# EAGLE schematic 197504_Kalibrierumschaltbaugruppe_seriell_2017_09_06_komplett (EAGLE 6.4)
Assembly variants: Relais_Switchbox_USB, Development_Board_Graphic_LCD, Development_Board_7_Segment_2017

## Sheet 1 of 8
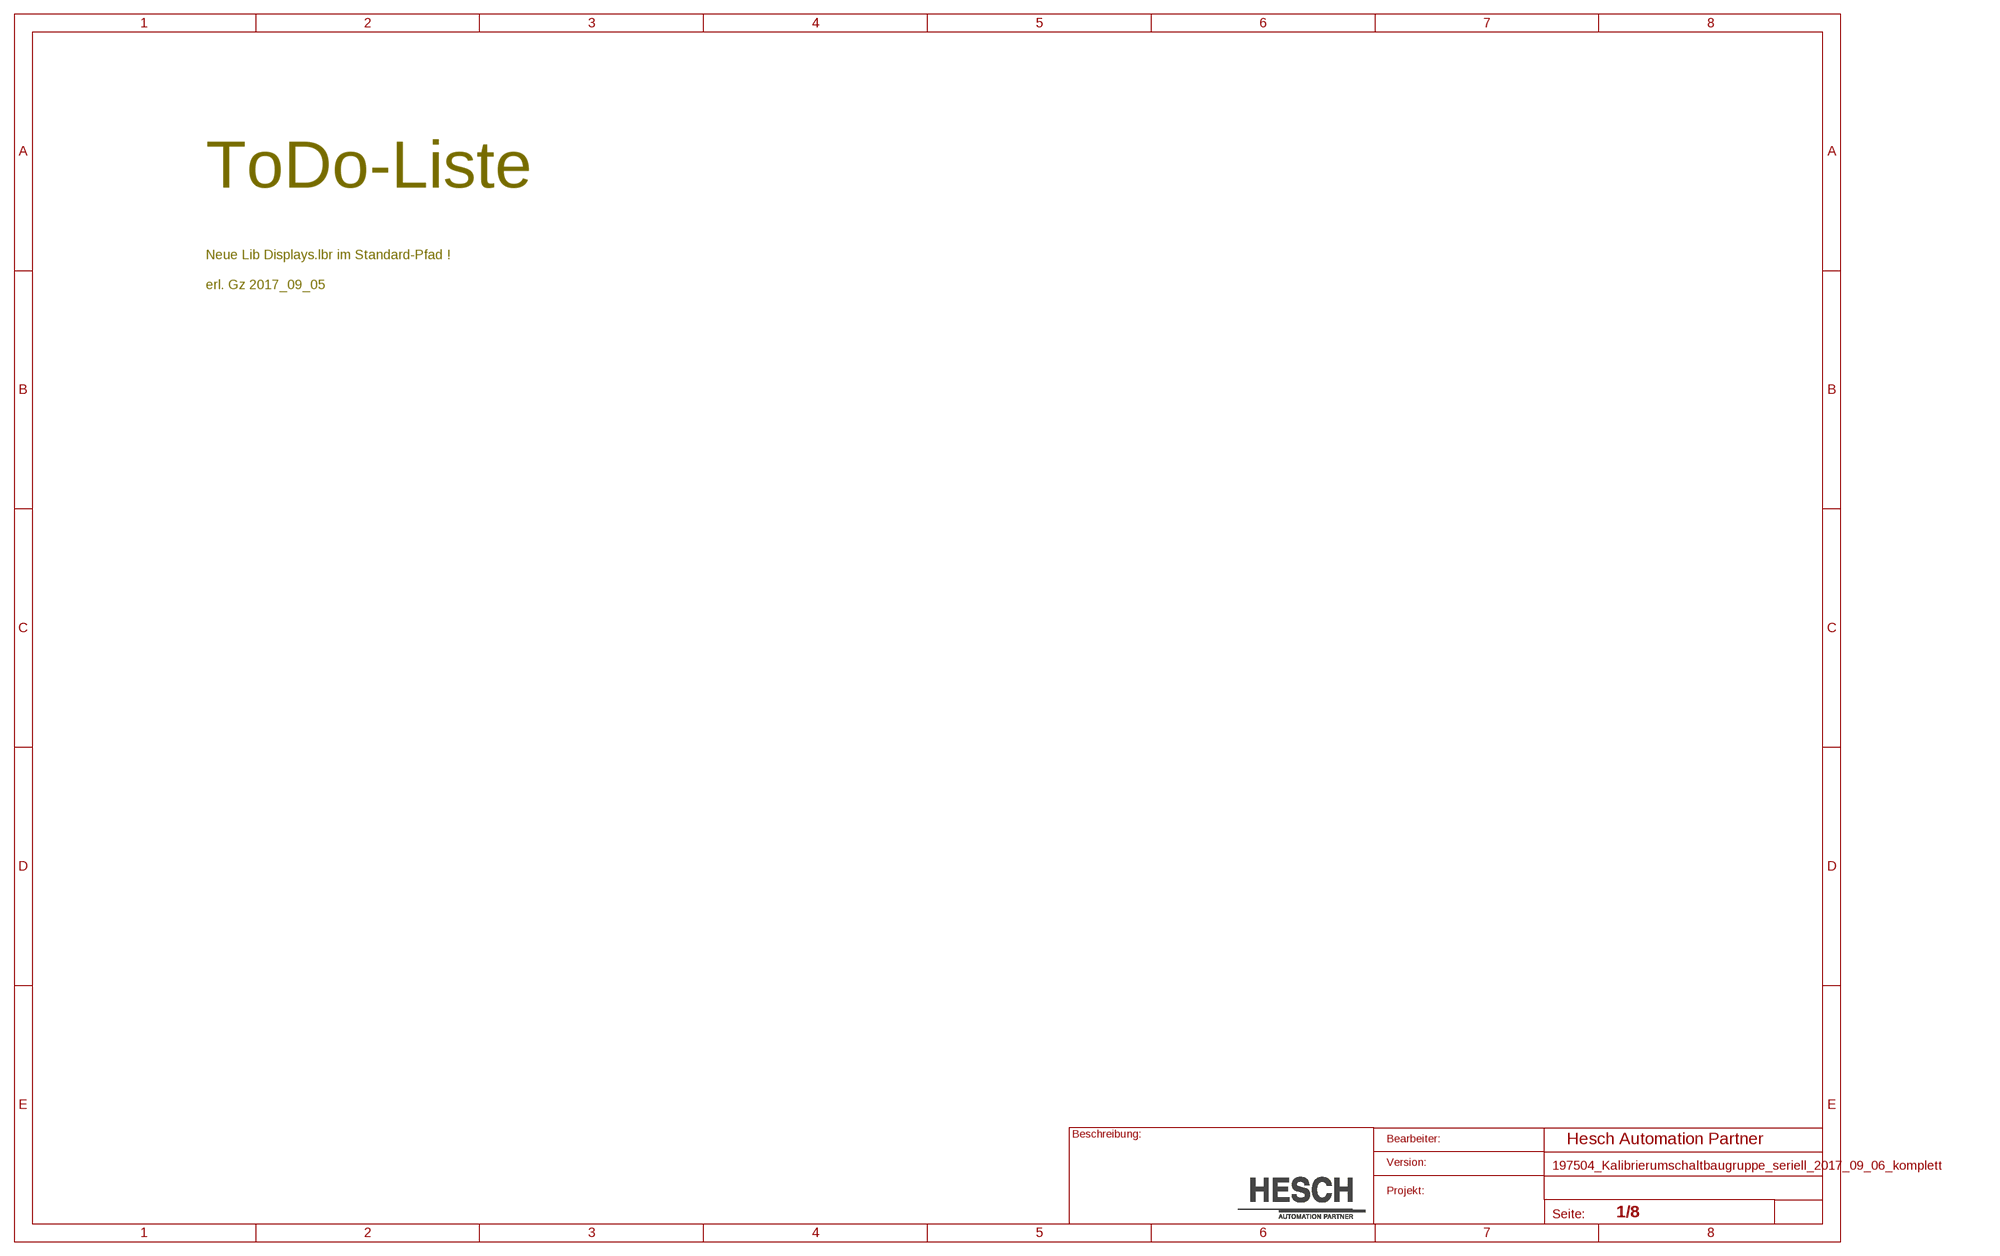
[diagram p0: schematic, sheet 1]

### Notes on the sheet
- ToDo-Liste
- Neue Lib Displays.lbr im Standard-Pfad !
- erl. Gz 2017_09_05

## Sheet 2 of 8
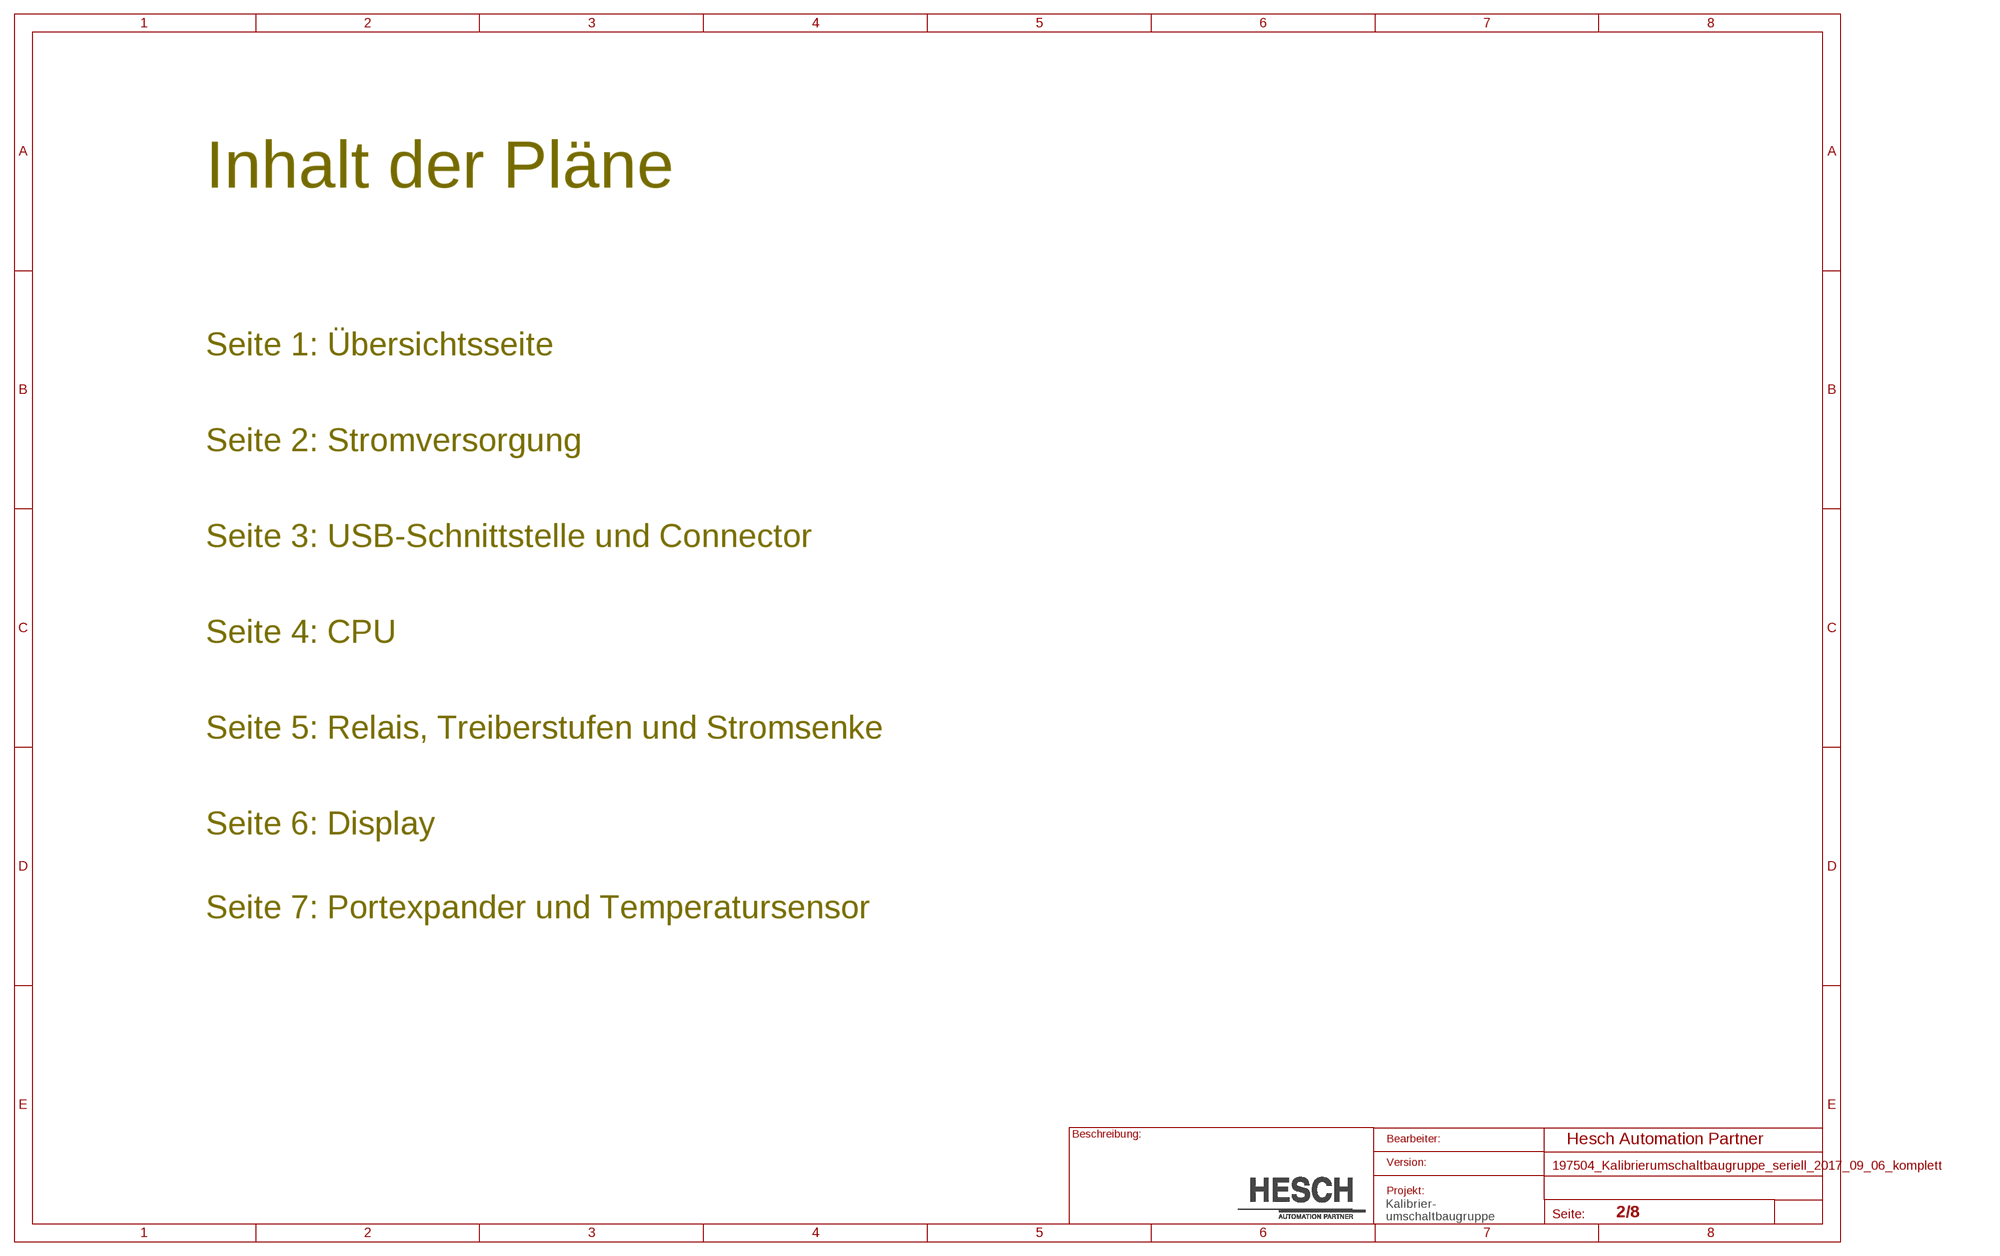
[diagram p1: schematic, sheet 2]

### Notes on the sheet
- Inhalt der Pläne
- Seite 1: Übersichtsseite
- Seite 2: Stromversorgung
- Seite 3: USB-Schnittstelle und Connector
- Seite 4: CPU
- Seite 5: Relais, Treiberstufen und Stromsenke
- Seite 6: Display
- Seite 7: Portexpander und Temperatursensor
- Kalibrier-
  umschaltbaugruppe

## Sheet 3 of 8
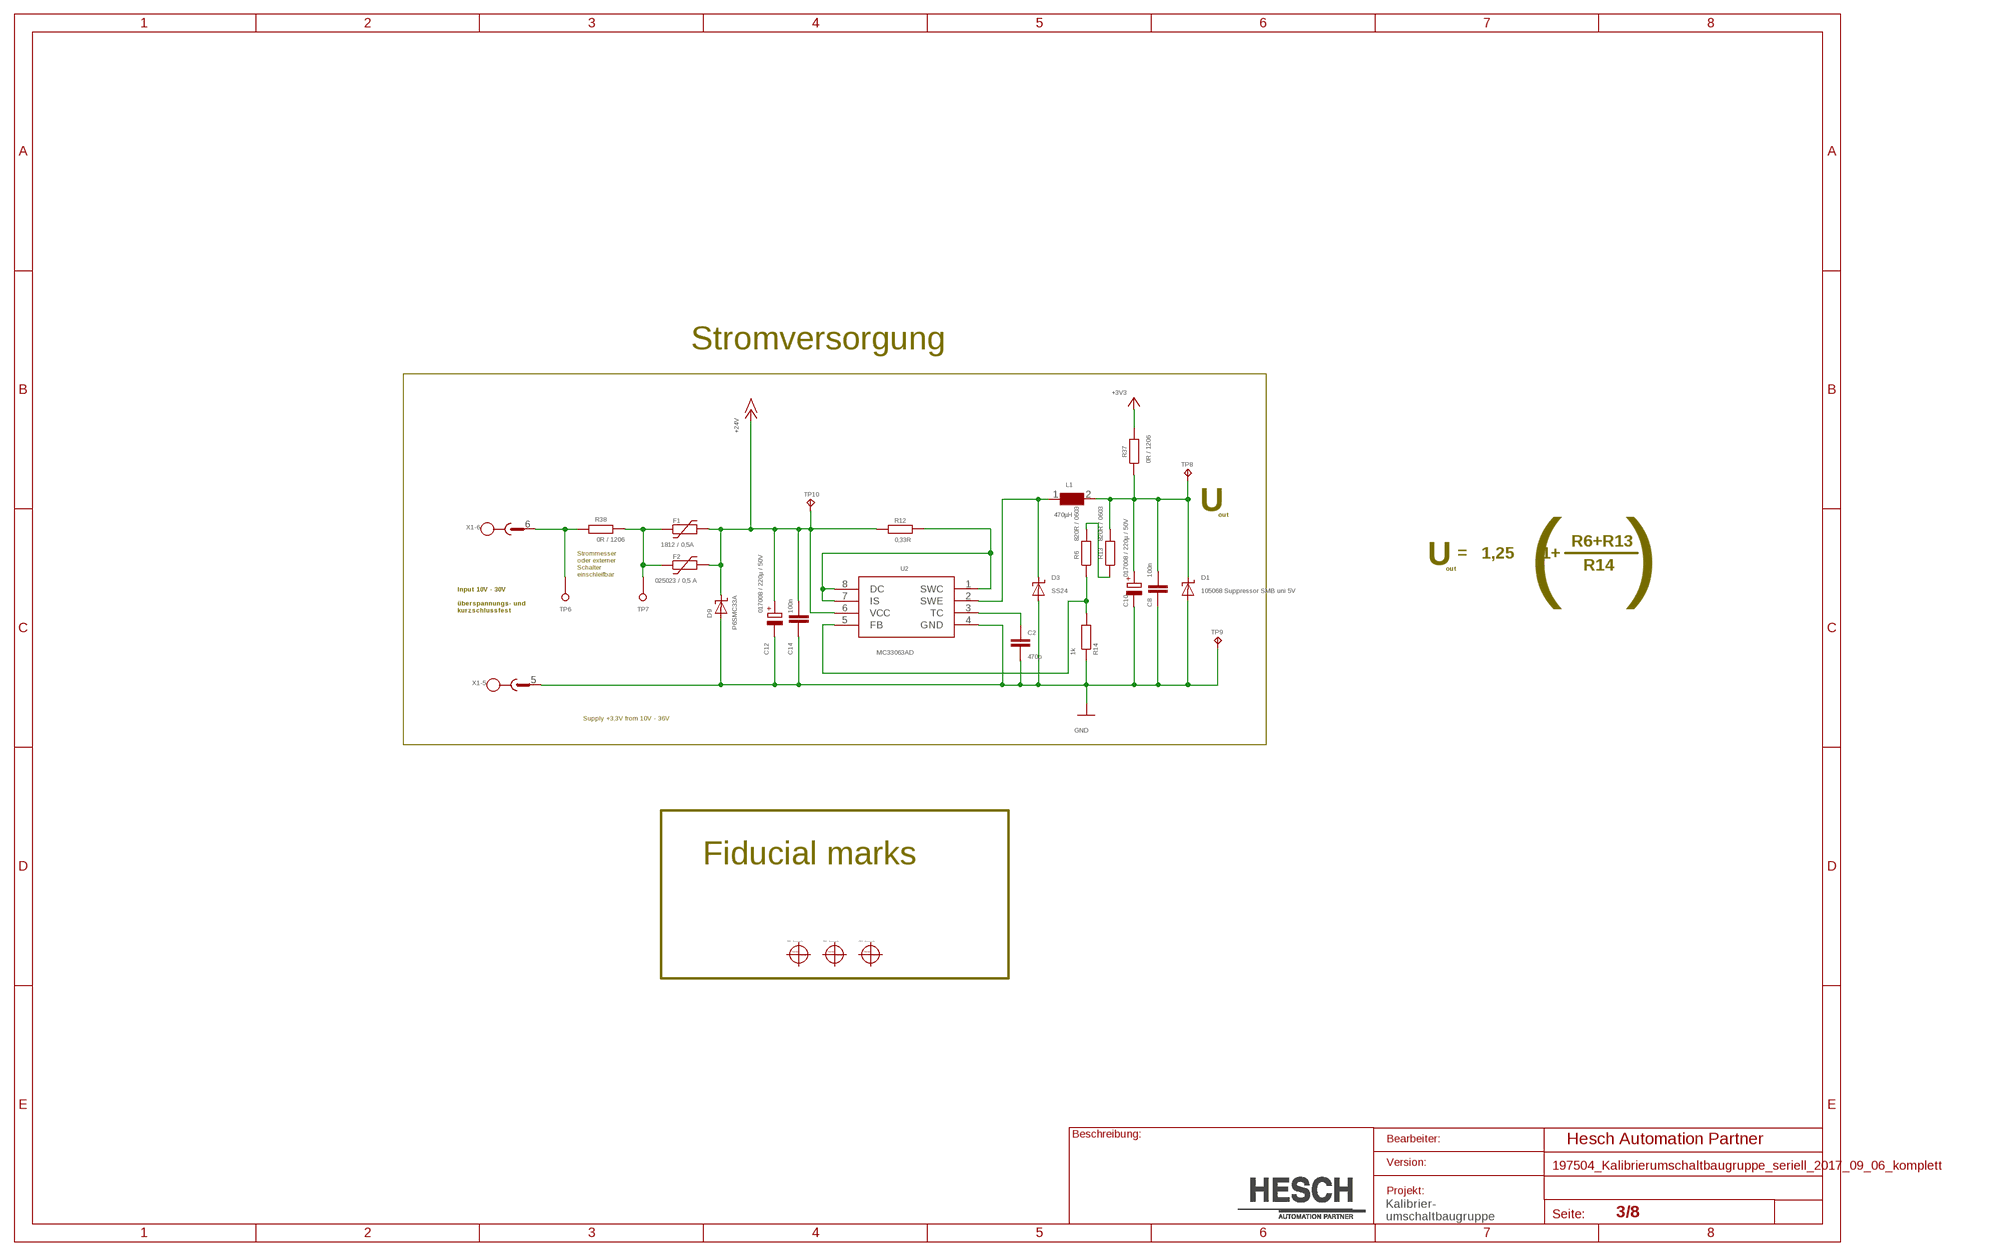
[diagram p2: schematic, sheet 3]

### Parts
C2  470p  C-EUC0603  [C0603]
C8  100n  C-EUC0603  [C0603]
C10  017008 / 220µ / 50V  CPOL-EU153CLV-1014  [153CLV-1014]
C12  017008 / 220µ / 50V  CPOL-EU153CLV-1014  [153CLV-1014]
C14  100n  C-EUC0603  [C0603]
D1  105068 Suppressor SMB uni 5V  SUPPRESSOR-SMBJ  [SMBJ]
D3  SS24  SUPPRESSOR-SMBJ  [SMBJ]
D9  P6SMC33A  SUPPRESSOR-SMCJ  [SMC]
F1  1812 / 0,5A  1812SMD  [1812L]  (not fitted in variant Relais_Switchbox_USB)  (not fitted in variant Development_Board_Graphic_LCD)  (not fitted in variant Development_Board_7_Segment_2017)
F2  025023 / 0,5 A  1206LSMD  [1206L]
FIDU1  Passermarke  FIDUCIALSMARKE_1MM  [PASSER_1MM]
FIDU2  Passermarke  FIDUCIALSMARKE_1MM  [PASSER_1MM]
FIDU3  Passermarke  FIDUCIALSMARKE_1MM  [PASSER_1MM]
L1  470µH  WE-PD4_L  [L]
R6  820R / 0603  R-EU_R0603  [R0603]
R12  0,33R  R-EU_R1206  [R1206]
R13  820R / 0603  R-EU_R0603  [R0603]
R14  1k  R-EU_R0603  [R0603]
R37  0R / 1206  R-EU_R1206  [R1206]
R38  0R / 1206  R-EU_R1206  [R1206]
TP6  Testpunkt_mit_Bohrung  PAD´S8  [THT-1X2,54]
TP7  Testpunkt_mit_Bohrung  PAD´S8  [THT-1X2,54]
TP8  TPB2,54  [B2,54]
TP9  TPB2,54  [B2,54]
TP10  TPB2,54  [B2,54]
U2  MC33063AD  MC34063AD  [SOIC8]
X1  MSTB 2,5/6-GF-5,08 AU ( Phoenix: 1949364 )  MSTB6_GF  [MSTB6_GF]

### Nets
3V3_STABILIZED_OUT: C8.1 C10.+ D1.C L1.2 R13.2 R37.1 TP8.PP(TP)
+3V3: R37.2 ; also sheet 5,6,7,8
+24V: C12.+ C14.1 D9.C F1.2 F2.2 R12.2 TP10.PP(TP) U2.6(VCC)
GND: C2.2 C8.2 C10.- C12.- C14.2 D1.A D3.A D9.A R14.1 TP9.PP(TP) U2.4(GND) X1.5 ; also sheet 4,5,6,7,8
N$3: F1.1 F2.1 R38.1 TP7.TP
N$25: R12.1 U2.1(SWC) U2.7(IS) U2.8(DC)
N$27: R6.2 R13.1
N$29: D3.C L1.1 U2.2(SWE)
N$30: R6.1 R14.2 U2.5(FB)
N$31: R38.2 TP6.TP X1.6
N$33: C2.1 U2.3(TC)

### Notes on the sheet
- Stromversorgung
- U
- out
- R6+R13
- = | 1,25 | 1+
- U
- out | R14
- Strommesser
  oder externer
  Schalter
  einschleifbar
- ( | )
- Input 10V - 30V
  
  überspannungs- und
  kurzschlussfest
- Supply +3,3V from 10V - 36V
- Fiducial marks
- Kalibrier-
  umschaltbaugruppe

## Sheet 4 of 8
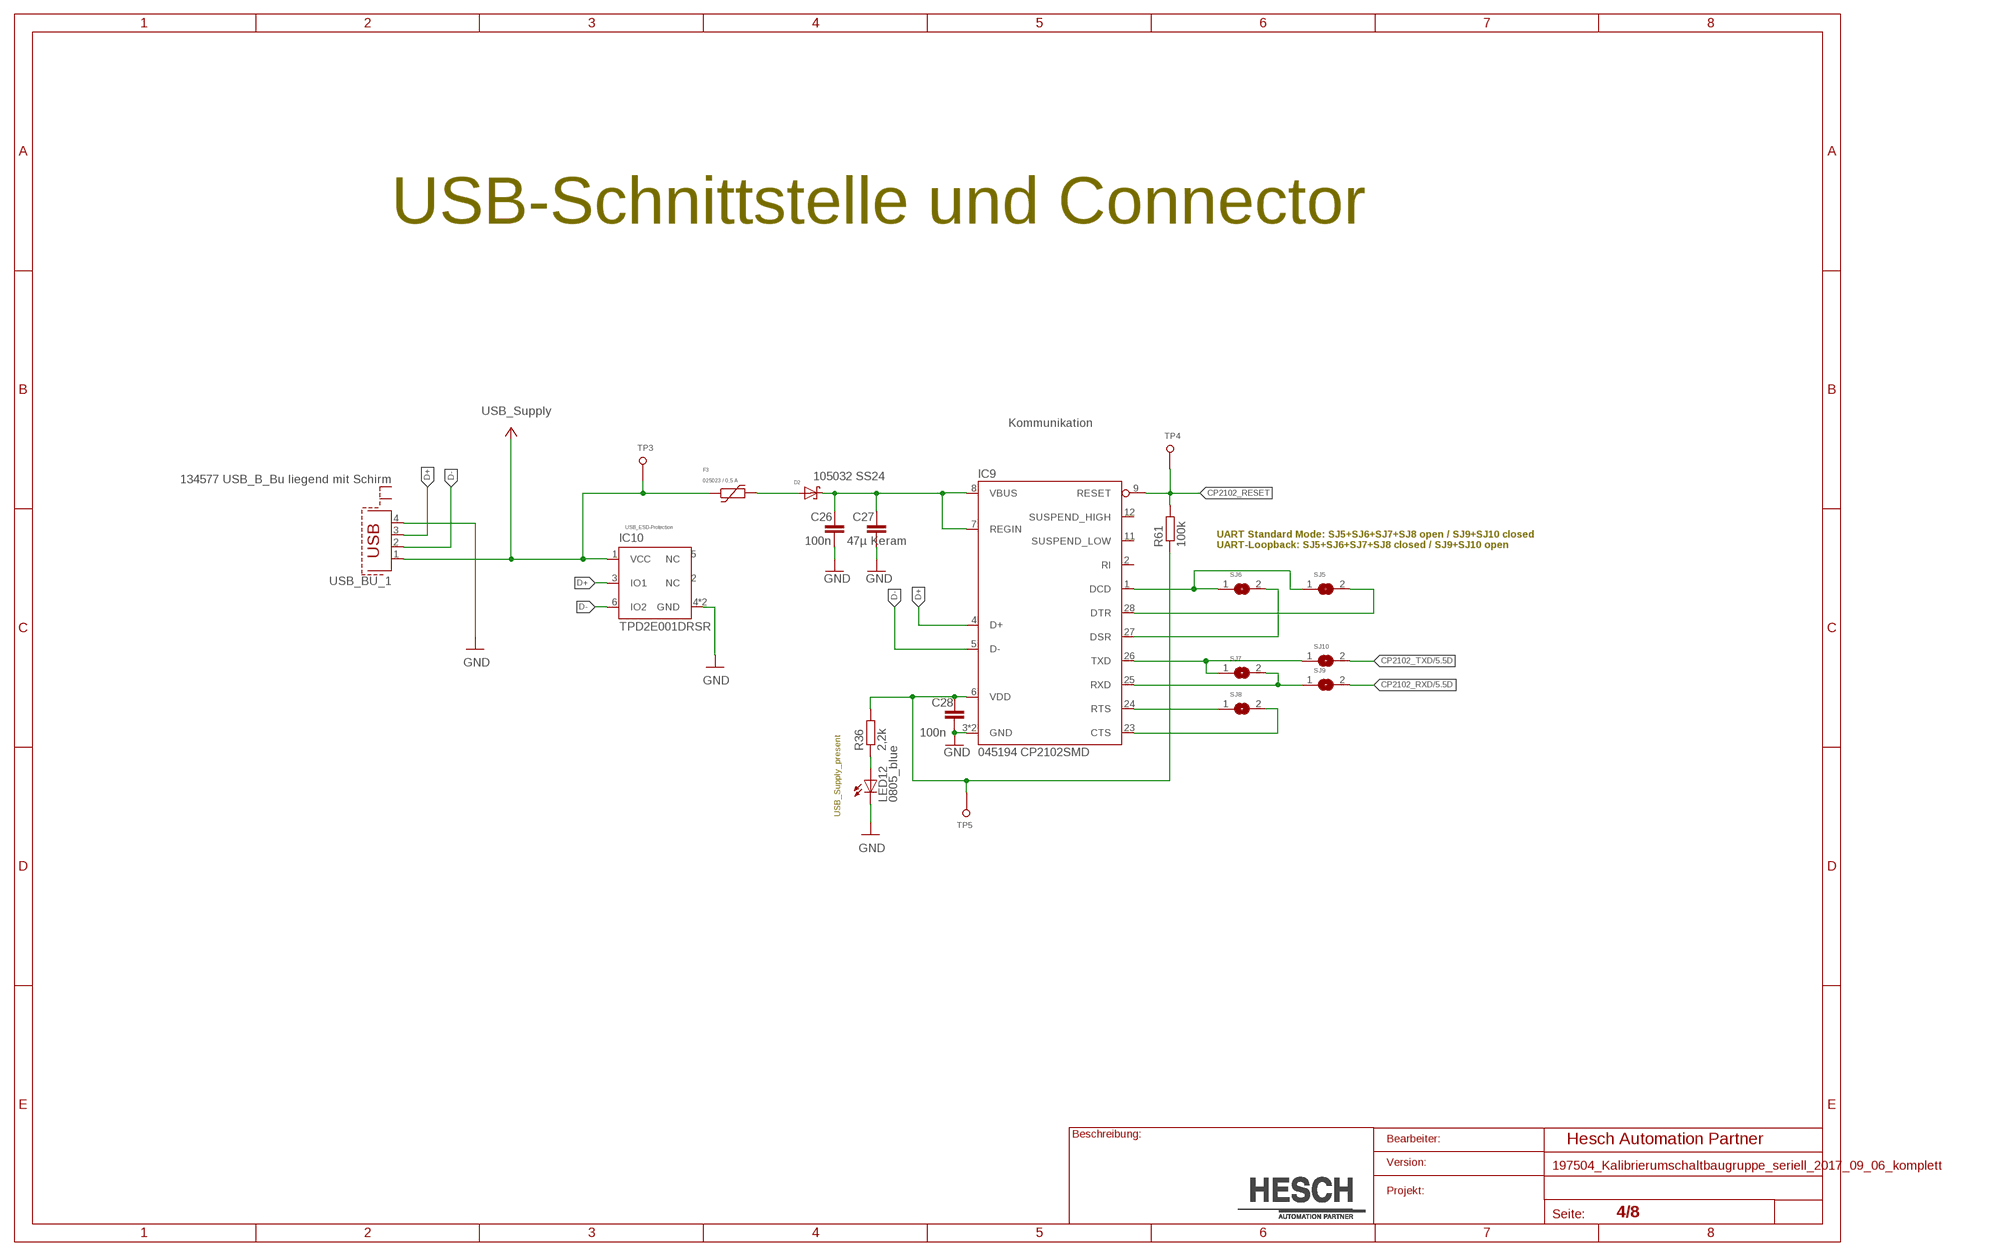
[diagram p3: schematic, sheet 4]

### Parts
C26  100n  C-EUC0603  [C0603]
C27  47µ Keram  C-EUC1210  [C1210]
C28  100n  C-EUC0603  [C0603]
D2  105032 SS24  SS24R4  [DO-214AA/SMB]
F3  025023 / 0,5 A  1206LSMD  [1206L]
IC9  045194 CP2102SMD  CP2102SMD  [QFN28]
IC10  TPD2E001DRSR  [DRS]
LED12  0805_blue  LEDCHIPLED_0805  [CHIPLED_0805]
R36  2,2k  R-EU_R0603  [R0603]
R61  100k  R-EU_R0603  [R0603]
SJ5  Lötjumper  SJ  [SJ]
SJ6  Lötjumper  SJ  [SJ]
SJ7  Lötjumper  SJ  [SJ]
SJ8  Lötjumper  SJ  [SJ]
SJ9  Lötjumper  SJ  [SJ]
SJ10  Lötjumper  SJ  [SJ]
TP3  Testpunkt_mit_Bohrung  PAD´S8  [THT-1X2,54]
TP4  Testpunkt_mit_Bohrung  PAD´S8  [THT-1X2,54]
TP5  Testpunkt_mit_Bohrung  PAD´S8  [THT-1X2,54]
USB_BU_1  134577 USB_B_Bu liegend mit Schirm  PN61729-S  [PN61729-S]

### Nets
CP2102_RESET: IC9.9(RESET) R61.2 TP4.TP
CP2102_RXD: SJ9.2 ; also sheet 5
CP2102_RXD_: IC9.26(TXD) SJ7.1 SJ10.1
CP2102_TXD: SJ10.2 ; also sheet 5
CP2102_TXD_: IC9.25(RXD) SJ7.2 SJ9.1
CTS: IC9.23(CTS) SJ8.2
D+: IC9.4(D+) IC10.3(IO1) USB_BU_1.3
D-: IC9.5(D-) IC10.6(IO2) USB_BU_1.2
DCD: IC9.1(DCD) SJ5.1 SJ6.1
DSR: IC9.27(DSR) SJ6.2
DTR: IC9.28(DTR) SJ5.2
GND: C26.2 C27.2 C28.2 IC9.3(GND) IC9.THERMAL(GND) IC10.4(GND) IC10.THERMAL(GND) LED12.C USB_BU_1.4 ; also sheet 3,5,6,7,8
N$22: LED12.A R36.1
N$73: D2.A F3.2
RTS: IC9.24(RTS) SJ8.1
USB_REG_OUT: C28.1 IC9.6(VDD) R36.2 R61.1 TP5.TP
USB_SUPPLY: F3.1 IC10.1(VCC) TP3.TP USB_BU_1.1 ; supply symbol labelled USB_Supply
VBUS_REGIN1: C26.1 C27.1 D2.C IC9.7(REGIN) IC9.8(VBUS)
Unconnected: IC9.2(RI) IC9.11(SUSPEND_LOW) IC9.12(SUSPEND_HIGH) IC10.2(NC) IC10.5(NC) USB_BU_1.S1 USB_BU_1.S2

### Notes on the sheet
- USB-Schnittstelle und Connector
- Kommunikation
- USB_ESD-Protection
- UART Standard Mode: SJ5+SJ6+SJ7+SJ8 open / SJ9+SJ10 closed
  UART-Loopback: SJ5+SJ6+SJ7+SJ8 closed / SJ9+SJ10 open
- USB_Supply_present

## Sheet 5 of 8
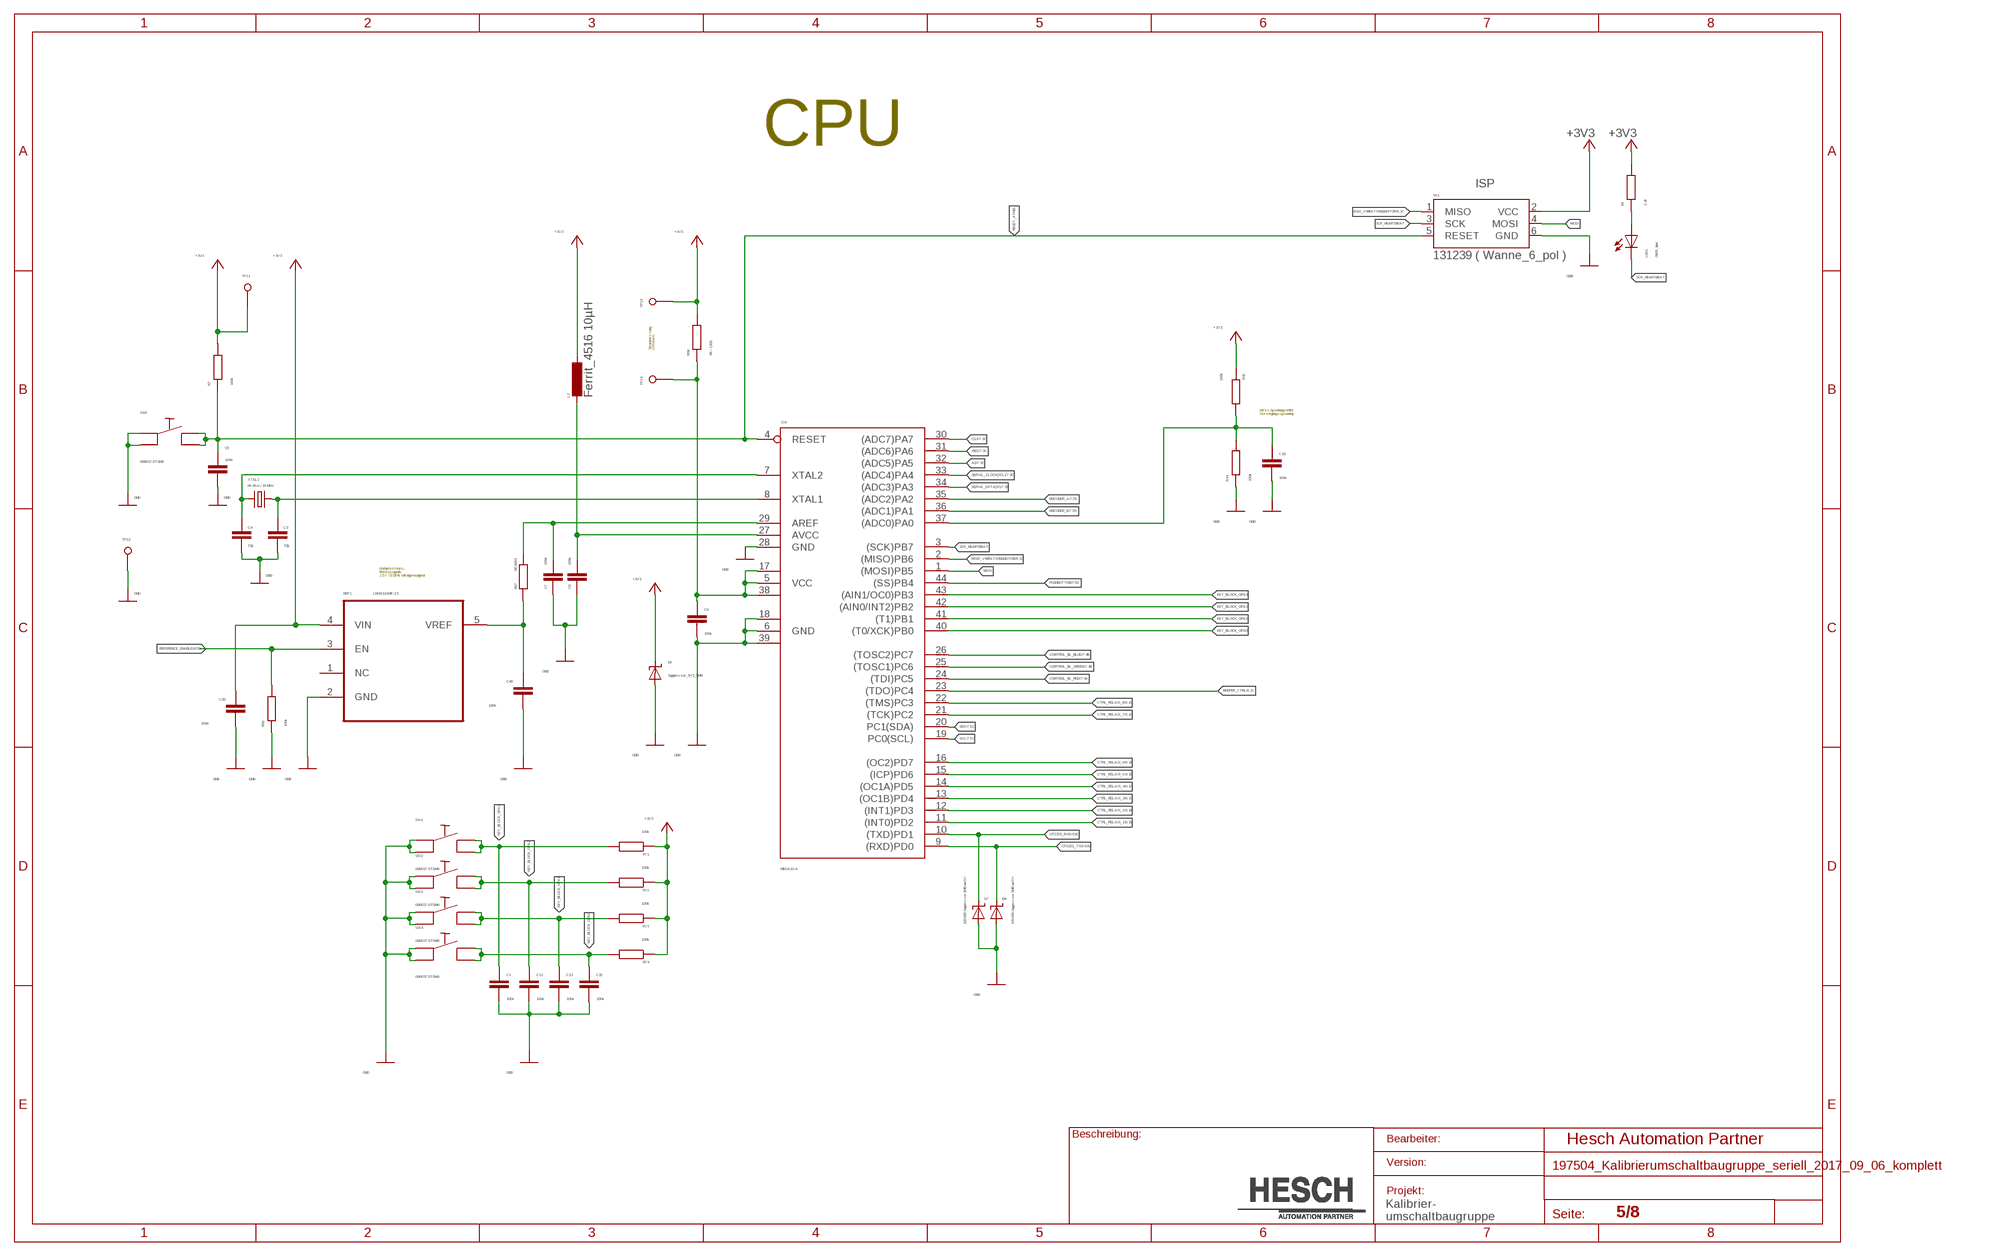
[diagram p4: schematic, sheet 5]

### Parts
C1  100n  C-EUC0603  [C0603]
C3  22p  C-EUC0603  [C0603]
C4  22p  C-EUC0603  [C0603]
C5  100n  C-EUC0603  [C0603]
C6  100n  C-EUC0603  [C0603]
C7  100n  C-EUC0603  [C0603]
C9  100n  C-EUC0603  [C0603]
C11  100n  C-EUC0603  [C0603]
C13  100n  C-EUC0603  [C0603]
C15  100n  C-EUC0603  [C0603]
C18  100n  C-EUC0603  [C0603]
C39  100n  C-EUC0603  [C0603]  (not fitted in variant Relais_Switchbox_USB)  (not fitted in variant Development_Board_Graphic_LCD)
C40  100n  C-EUC0603  [C0603]  (not fitted in variant Relais_Switchbox_USB)  (not fitted in variant Development_Board_Graphic_LCD)
D5  Suppressor_3V3_SMB  SUPPRESSOR-SMBJ  [SMBJ]
D7  105068 Suppressor SMB uni 5V  SUPPRESSOR-SMBJ  [SMBJ]
D8  105068 Suppressor SMB uni 5V  SUPPRESSOR-SMBJ  [SMBJ]
IC8  MEGA32-A  [TQFP44]
L2  Ferrit_4516 10µH  L-EUL4516C  [L4516C]
LED1  0805_blue  LEDCHIPLED_0805  [CHIPLED_0805]
R5  2,2k  R-EU_R0603  [R0603]
R7  100k  R-EU_R0603  [R0603]
R34  100k  R-EU_R0603  [R0603]
R35  100k  R-EU_R0603  [R0603]
R66  100k  R-EU_R0603  [R0603]  (not fitted in variant Relais_Switchbox_USB)  (not fitted in variant Development_Board_Graphic_LCD)
R67  0R 0603  R-EU_R0603  [R0603]  (not fitted in variant Relais_Switchbox_USB)  (not fitted in variant Development_Board_Graphic_LCD)
R68  0R / 1206  R-EU_R1206  [R1206]
R71  100k  R-EU_R0603  [R0603]
R72  100k  R-EU_R0603  [R0603]
R73  100k  R-EU_R0603  [R0603]
R74  100k  R-EU_R0603  [R0603]
REF1  LM4132AMF-2.5  [SOT95P284X122-5N]  (not fitted in variant Relais_Switchbox_USB)  (not fitted in variant Development_Board_Graphic_LCD)
SW1  088037 DTSM6  DIP_DTSM6SMD  [DTSM6]  (not fitted in variant Relais_Switchbox_USB)
SW2  088037 DTSM6  DIP_DTSM6SMD  [DTSM6]  (not fitted in variant Relais_Switchbox_USB)
SW3  088037 DTSM6  DIP_DTSM6SMD  [DTSM6]  (not fitted in variant Relais_Switchbox_USB)
SW4  088037 DTSM6  DIP_DTSM6SMD  [DTSM6]  (not fitted in variant Relais_Switchbox_USB)
SW5  088037 DTSM6  DIP_DTSM6SMD  [DTSM6]
TP11  Testpunkt_mit_Bohrung  PAD´S8  [THT-1X2,54]
TP12  Testpunkt_mit_Bohrung  PAD´S8  [THT-1X2,54]
TP13  Testpunkt_mit_Bohrung  PAD´S8  [THT-1X2,54]
TP14  Testpunkt_mit_Bohrung  PAD´S8  [THT-1X2,54]
XK1  131239 ( Wanne_6_pol )  WSL6  [WSL]
XTAL1  HC49-U / 16 MHz  HC49-U  [HC49]

### Nets
+3V3: C39.1 D5.C L2.1 R5.2 R7.2 R35.1 R68.2 R71.1 R72.1 R73.1 R74.1 REF1.4(VIN) TP11.TP TP13.TP XK1.2(VCC) ; also sheet 3,6,7,8
/RES: IC8.31((ADC6)PA6) ; also sheet 7
A0: IC8.32((ADC5)PA5) ; also sheet 7
AREF: C7.1 IC8.29(AREF) R67.2
AVCC: C6.1 IC8.27(AVCC) L2.2
BEEPER_CTRL: IC8.23((TDO)PC4) ; also sheet 6
CONTROL_BL_BLUE: IC8.26((TOSC2)PC7) ; also sheet 7
CONTROL_BL_GREEN: IC8.25((TOSC1)PC6) ; also sheet 7
CONTROL_BL_RED: IC8.24((TDI)PC5) ; also sheet 7
CP2102_RXD: D7.C IC8.10((TXD)PD1) ; also sheet 4
CP2102_TXD: D8.C IC8.9((RXD)PD0) ; also sheet 4
CS1: IC8.30((ADC7)PA7) ; also sheet 7
CTRL_RELAIS_1: IC8.11((INT0)PD2) ; also sheet 6
CTRL_RELAIS_2: IC8.12((INT1)PD3) ; also sheet 6
CTRL_RELAIS_3: IC8.13((OC1B)PD4) ; also sheet 6
CTRL_RELAIS_4: IC8.14((OC1A)PD5) ; also sheet 6
CTRL_RELAIS_5: IC8.15((ICP)PD6) ; also sheet 6
CTRL_RELAIS_6: IC8.16((OC2)PD7) ; also sheet 6
CTRL_RELAIS_7: IC8.21((TCK)PC2) ; also sheet 6
CTRL_RELAIS_8: IC8.22((TMS)PC3) ; also sheet 6
ENCODER_A: IC8.35((ADC2)PA2) ; also sheet 7
ENCODER_B: IC8.36((ADC1)PA1) ; also sheet 7
GND: C1.2 C3.2 C4.2 C5.2 C6.2 C7.2 C9.2 C11.2 C13.2 C15.2 C18.2 C39.2 C40.2 D5.A D7.A D8.A IC8.6(GND) IC8.18(GND1) IC8.28(GND) IC8.39(GND2) R34.1 R66.1 REF1.2(GND) SW1.1 SW1.2 SW2.1 SW2.2 SW3.1 SW3.2 SW4.1 SW4.2 SW5.1 SW5.2 TP12.TP XK1.6(GND) ; also sheet 3,4,6,7,8
KEY_BLOCK_GPA0: C15.1 IC8.40((T0/XCK)PB0) R74.2 SW4.3 SW4.4
KEY_BLOCK_GPA1: C13.1 IC8.41((T1)PB1) R73.2 SW3.3 SW3.4
KEY_BLOCK_GPA2: C11.1 IC8.42((AIN0/INT2)PB2) R72.2 SW2.3 SW2.4
KEY_BLOCK_GPA3: C1.1 IC8.43((AIN1/OC0)PB3) R71.2 SW1.3 SW1.4
MESSGRößE_VERSORGUNGSSPANNUNG: C18.1 IC8.37((ADC0)PA0) R34.2 R35.2
MISO_VIBRATIONSMOTOR: IC8.2((MISO)PB6) XK1.1(MISO) ; also sheet 6
MOSI: IC8.1((MOSI)PB5) XK1.4(MOSI)
N$4: C9.1 IC8.5(VCC) IC8.17(VCC1) IC8.38(VCC2) R68.1 TP14.TP
N$16: LED1.A R5.1
PUSHBUTTON: IC8.44((SS)PB4) ; also sheet 7
REFERENCE_ENABLE: R66.2 REF1.3(EN) ; also sheet 8
RESET_ATMEL: C5.1 IC8.4(RESET) R7.1 SW5.3 SW5.4 XK1.5(RESET)
SCK_HEARTBEAT: IC8.3((SCK)PB7) LED1.C XK1.3(SCK)
SCL: IC8.19(PC0(SCL)) ; also sheet 7,8
SDA: IC8.20(PC1(SDA)) ; also sheet 7,8
SERIAL_CLOCK(SCL): IC8.33((ADC4)PA4) ; also sheet 7
SERIAL_DATA(SI): IC8.34((ADC3)PA3) ; also sheet 7
V_REF_OUT: C40.1 R67.1 REF1.5(VREF)
XTAL1: C3.1 IC8.8(XTAL1) XTAL1.1
XTAL2: C4.1 IC8.7(XTAL2) XTAL1.2
Unconnected: REF1.1(NC)

### Notes on the sheet
- CPU
- ISP
- Strommessung
  CPU-Kreis
- Mess-Spannungsteiler
  Versorgungsspannung
- Hochpräzisions-
  Referenzquelle
  2,5V / 0,05% Initialgenauigkeit
- Kalibrier-
  umschaltbaugruppe

## Sheet 6 of 8
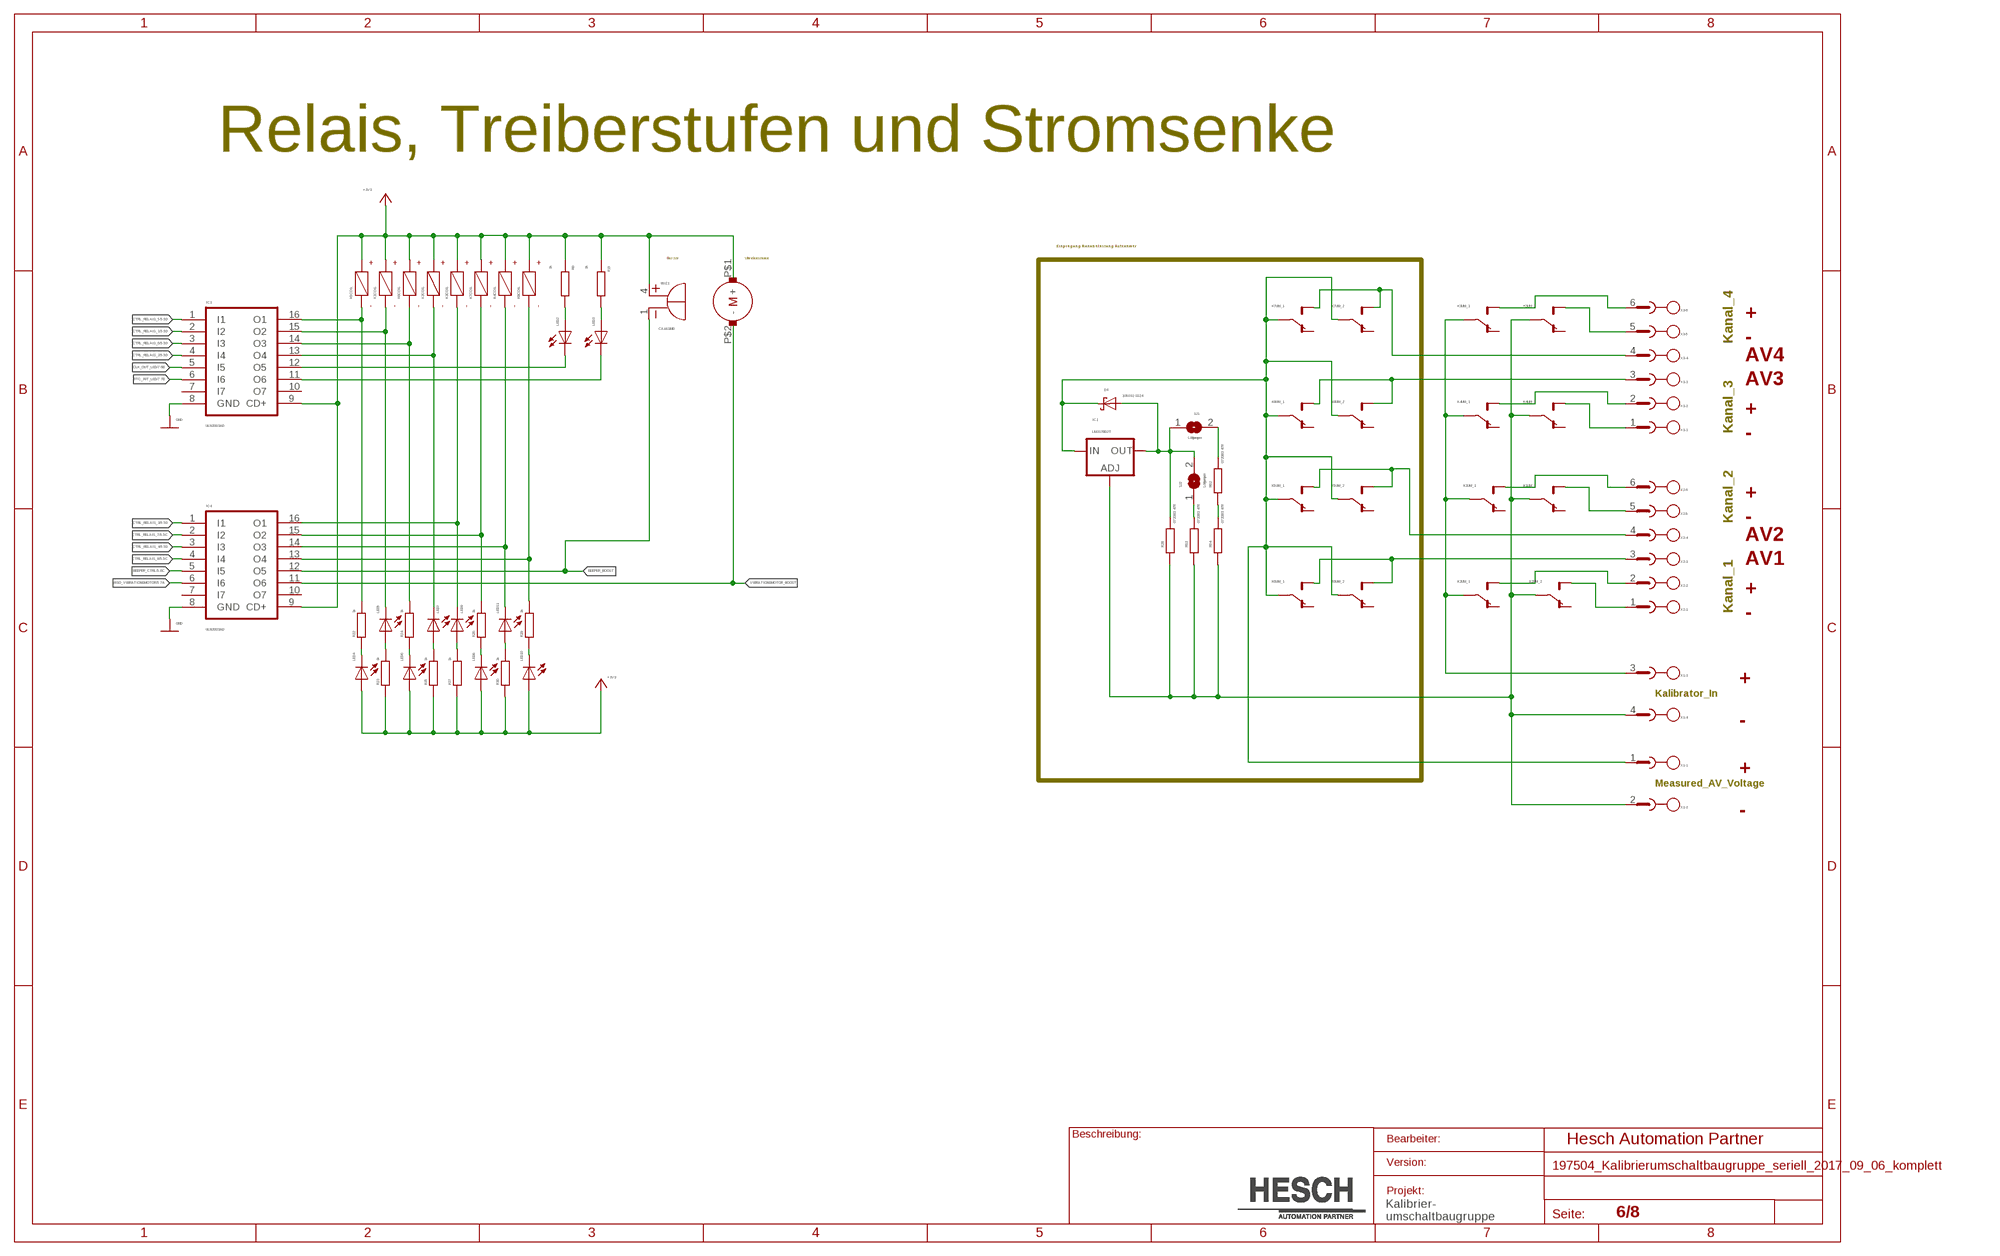
[diagram p5: schematic, sheet 6]

### Parts
BUZ1  CA-M-SMD  [SMD]  (not fitted in variant Relais_Switchbox_USB)
D4  105032 SS24  SS24R4  [DO-214AA/SMB]
IC1  LM317BD2T  [D2PACK]  (not fitted in variant Development_Board_Graphic_LCD)  (not fitted in variant Development_Board_7_Segment_2017)
IC3  ULN2003AD  [SO16]
IC4  ULN2003AD  [SO16]
K1  # 035004 / TQ2SA-3V-Z TQ2SA-3V  PANASONIC_TQ_SMD  [PANASONIC_TQ_SMD]  (not fitted in variant Development_Board_Graphic_LCD)  (not fitted in variant Development_Board_7_Segment_2017)
K2  # 035004 / TQ2SA-3V-Z TQ2SA-3V  PANASONIC_TQ_SMD  [PANASONIC_TQ_SMD]  (not fitted in variant Development_Board_Graphic_LCD)  (not fitted in variant Development_Board_7_Segment_2017)
K3  # 035004 / TQ2SA-3V-Z TQ2SA-3V  PANASONIC_TQ_SMD  [PANASONIC_TQ_SMD]  (not fitted in variant Development_Board_Graphic_LCD)  (not fitted in variant Development_Board_7_Segment_2017)
K4  # 035004 / TQ2SA-3V-Z TQ2SA-3V  PANASONIC_TQ_SMD  [PANASONIC_TQ_SMD]  (not fitted in variant Development_Board_Graphic_LCD)  (not fitted in variant Development_Board_7_Segment_2017)
K5  # 035004 / TQ2SA-3V-Z TQ2SA-3V  PANASONIC_TQ_SMD  [PANASONIC_TQ_SMD]  (not fitted in variant Development_Board_Graphic_LCD)  (not fitted in variant Development_Board_7_Segment_2017)
K6  # 035004 / TQ2SA-3V-Z TQ2SA-3V  PANASONIC_TQ_SMD  [PANASONIC_TQ_SMD]  (not fitted in variant Development_Board_Graphic_LCD)  (not fitted in variant Development_Board_7_Segment_2017)
K7  # 035004 / TQ2SA-3V-Z TQ2SA-3V  PANASONIC_TQ_SMD  [PANASONIC_TQ_SMD]  (not fitted in variant Development_Board_Graphic_LCD)  (not fitted in variant Development_Board_7_Segment_2017)
K8  # 035004 / TQ2SA-3V-Z TQ2SA-3V  PANASONIC_TQ_SMD  [PANASONIC_TQ_SMD]  (not fitted in variant Development_Board_Graphic_LCD)  (not fitted in variant Development_Board_7_Segment_2017)
LED2  0805_blue  LEDCHIPLED_0805  [CHIPLED_0805]
LED3  0805_blue  LEDCHIPLED_0805  [CHIPLED_0805]
LED4  0805_blue  LEDCHIPLED_0805  [CHIPLED_0805]
LED5  0805_blue  LEDCHIPLED_0805  [CHIPLED_0805]
LED6  0805_blue  LEDCHIPLED_0805  [CHIPLED_0805]
LED7  0805_blue  LEDCHIPLED_0805  [CHIPLED_0805]
LED8  0805_blue  LEDCHIPLED_0805  [CHIPLED_0805]
LED9  0805_blue  LEDCHIPLED_0805  [CHIPLED_0805]
LED10  0805_blue  LEDCHIPLED_0805  [CHIPLED_0805]
LED11  0805_blue  LEDCHIPLED_0805  [CHIPLED_0805]
R8  1k  R-EU_R0603  [R0603]
R15  1k  R-EU_R0603  [R0603]
R22  1k  R-EU_R0805  [R0805]
R23  1k  R-EU_R0805  [R0805]
R24  1k  R-EU_R0805  [R0805]
R25  1k  R-EU_R0805  [R0805]
R26  1k  R-EU_R0805  [R0805]
R27  1k  R-EU_R0805  [R0805]
R28  072083 47R  R-EU_R2010  [R2010]  (not fitted in variant Development_Board_Graphic_LCD)  (not fitted in variant Development_Board_7_Segment_2017)
R29  1k  R-EU_R0805  [R0805]
R30  1k  R-EU_R0805  [R0805]
R62  072083 47R  R-EU_R2010  [R2010]  (not fitted in variant Development_Board_Graphic_LCD)  (not fitted in variant Development_Board_7_Segment_2017)
R63  072083 47R  R-EU_R2010  [R2010]  (not fitted in variant Development_Board_Graphic_LCD)  (not fitted in variant Development_Board_7_Segment_2017)
R64  072083 47R  R-EU_R2010  [R2010]  (not fitted in variant Development_Board_Graphic_LCD)  (not fitted in variant Development_Board_7_Segment_2017)
SJ1  Lötjumper  SJ  [SJ]  (not fitted in variant Relais_Switchbox_USB)  (not fitted in variant Development_Board_Graphic_LCD)
SJ2  Lötjumper  SJ  [SJ]  (not fitted in variant Relais_Switchbox_USB)  (not fitted in variant Development_Board_Graphic_LCD)
VM1  LA4-436B  VIBROMOTORTHT436B  [LA4-436B]  (not fitted in variant Relais_Switchbox_USB)
X2  MSTB 2,5/6-GF-5,08 AU ( Phoenix: 1949364 )  MSTB6_GF  [MSTB6_GF]
X3  MSTB 2,5/6-GF-5,08 AU ( Phoenix: 1949364 )  MSTB6_GF  [MSTB6_GF]

### Nets
+3V3: BUZ1.4(+) IC3.9(CD+) IC4.9(CD+) K1.1(COIL:PLUS) K2.1(COIL:PLUS) K3.1(COIL:PLUS) K4.1(COIL:PLUS) K5.1(COIL:PLUS) K6.1(COIL:PLUS) K7.1(COIL:PLUS) K8.1(COIL:PLUS) LED4.A LED6.A LED8.A LED10.A R8.1 R15.1 R23.2 R25.2 R27.2 R30.2 VM1.P$1(+) ; also sheet 3,5,7,8
AV_CHANNEL1: K6.4(UM_1:NO1) K6.7(UM_2:NO1) X2.3
AV_CHANNEL2: K5.4(UM_1:NO1) K5.7(UM_2:NO1) X2.4
AV_CHANNEL3: K8.4(UM_1:NO1) K8.7(UM_2:NO1) X3.3
AV_CHANNEL4: K7.4(UM_1:NO1) K7.7(UM_2:NO1) X3.4
BEEPER_BOOST: BUZ1.1(-) IC4.12(O5)
BEEPER_CTRL: IC4.5(I5) ; also sheet 5
CLK_OUT_LED: IC3.5(I5) ; also sheet 7
CLK_OUT_LED_: IC3.12(O5) LED2.C
CTRL_RELAIS_1: IC3.2(I2) ; also sheet 5
CTRL_RELAIS_2: IC3.4(I4) ; also sheet 5
CTRL_RELAIS_3: IC4.1(I1) ; also sheet 5
CTRL_RELAIS_4: IC4.3(I3) ; also sheet 5
CTRL_RELAIS_5: IC3.1(I1) ; also sheet 5
CTRL_RELAIS_6: IC3.3(I3) ; also sheet 5
CTRL_RELAIS_7: IC4.2(I2) ; also sheet 5
CTRL_RELAIS_8: IC4.4(I4) ; also sheet 5
GND: IC3.8(GND) IC4.8(GND) ; also sheet 3,4,5,7,8
KALIBRATOR+: K1.3(UM_1:COM1) K2.3(UM_1:COM1) K3.3(UM_1:COM1) K4.3(UM_1:COM1) X1.3
KALIBRATOR-: IC1.1(ADJ) K1.8(UM_2:COM1) K2.8(UM_2:COM1) K3.8(UM_2:COM1) K4.8(UM_2:COM1) R28.1 R63.1 R64.1 X1.2 X1.4
KNOTEN_AV_VOLTAGES: D4.C IC1.3(IN) K5.3(UM_1:COM1) K5.8(UM_2:COM1) K6.3(UM_1:COM1) K6.8(UM_2:COM1) K7.3(UM_1:COM1) K7.8(UM_2:COM1) K8.3(UM_1:COM1) K8.8(UM_2:COM1) X1.1
MISO_VIBRATIONSMOTOR: IC4.6(I6) ; also sheet 5
N$1: R63.2 SJ2.1
N$5: LED4.C R22.2
N$6: R62.1 R64.2
N$7: R62.2 SJ1.2
N$8: LED5.A R23.1
N$9: LED6.C R24.2
N$10: LED7.A R25.1
N$11: LED8.C R26.2
N$14: LED9.A R27.1
N$15: D4.A IC1.2(OUT) R28.2 SJ1.1 SJ2.2
N$17: LED10.C R29.2
N$18: LED11.A R30.1
N$21: LED3.A R15.2
N$26: LED2.A R8.2
N$39: K4.4(UM_1:NO1) X3.2
N$43: K2.7(UM_2:NO1) X2.1
N$44: K4.7(UM_2:NO1) X3.1
N$45: K3.7(UM_2:NO1) X3.5
N$46: K3.4(UM_1:NO1) X3.6
N$47: K2.4(UM_1:NO1) X2.2
N$48: K1.7(UM_2:NO1) X2.5
N$49: K1.4(UM_1:NO1) X2.6
REL_1_OUT: IC3.15(O2) K1.10(COIL:MINUS) LED5.C
REL_2_OUT: IC3.13(O4) K2.10(COIL:MINUS) LED7.C
REL_3_OUT: IC4.16(O1) K3.10(COIL:MINUS) LED9.C
REL_4_OUT: IC4.14(O3) K4.10(COIL:MINUS) LED11.C
REL_5_OUT: IC3.16(O1) K5.10(COIL:MINUS) R22.1
REL_7_OUT: IC4.15(O2) K7.10(COIL:MINUS) R26.1
REL_8_OUT: IC4.13(O4) K8.10(COIL:MINUS) R29.1
RELAIS_6_OUT: IC3.14(O3) K6.10(COIL:MINUS) R24.1
RTC_INT_LED: IC3.6(I6) ; also sheet 7
RTC_INT_LED_: IC3.11(O6) LED3.C
VIBRATIONSMOTOR_BOOST: IC4.11(O6) VM1.P$2(-)
Unconnected: IC3.7(I7) IC3.10(O7) IC4.7(I7) IC4.10(O7) K1.2(UM_1:NC1) K1.9(UM_2:NC1) K2.2(UM_1:NC1) K2.9(UM_2:NC1) K3.2(UM_1:NC1) K3.9(UM_2:NC1) K4.2(UM_1:NC1) K4.9(UM_2:NC1) K5.2(UM_1:NC1) K5.9(UM_2:NC1) K6.2(UM_1:NC1) K6.9(UM_2:NC1) K7.2(UM_1:NC1) K7.9(UM_2:NC1) K8.2(UM_1:NC1) K8.9(UM_2:NC1)

### Notes on the sheet
- Relais, Treiberstufen und Stromsenke
- Einprägung Nennbelastung Aufnehmer
- Buzzer | Vibrationsmotor
- +
- Kanal_4 | -
- AV4
- AV3
- +
- Kanal_3
- -
- +
- Kanal_2 | -
- AV2
- AV1
- +
- Kanal_1
- -
- +
- Kalibrator_In
- -
- +
- Measured_AV_Voltage
- -
- Kalibrier-
  umschaltbaugruppe

## Sheet 7 of 8
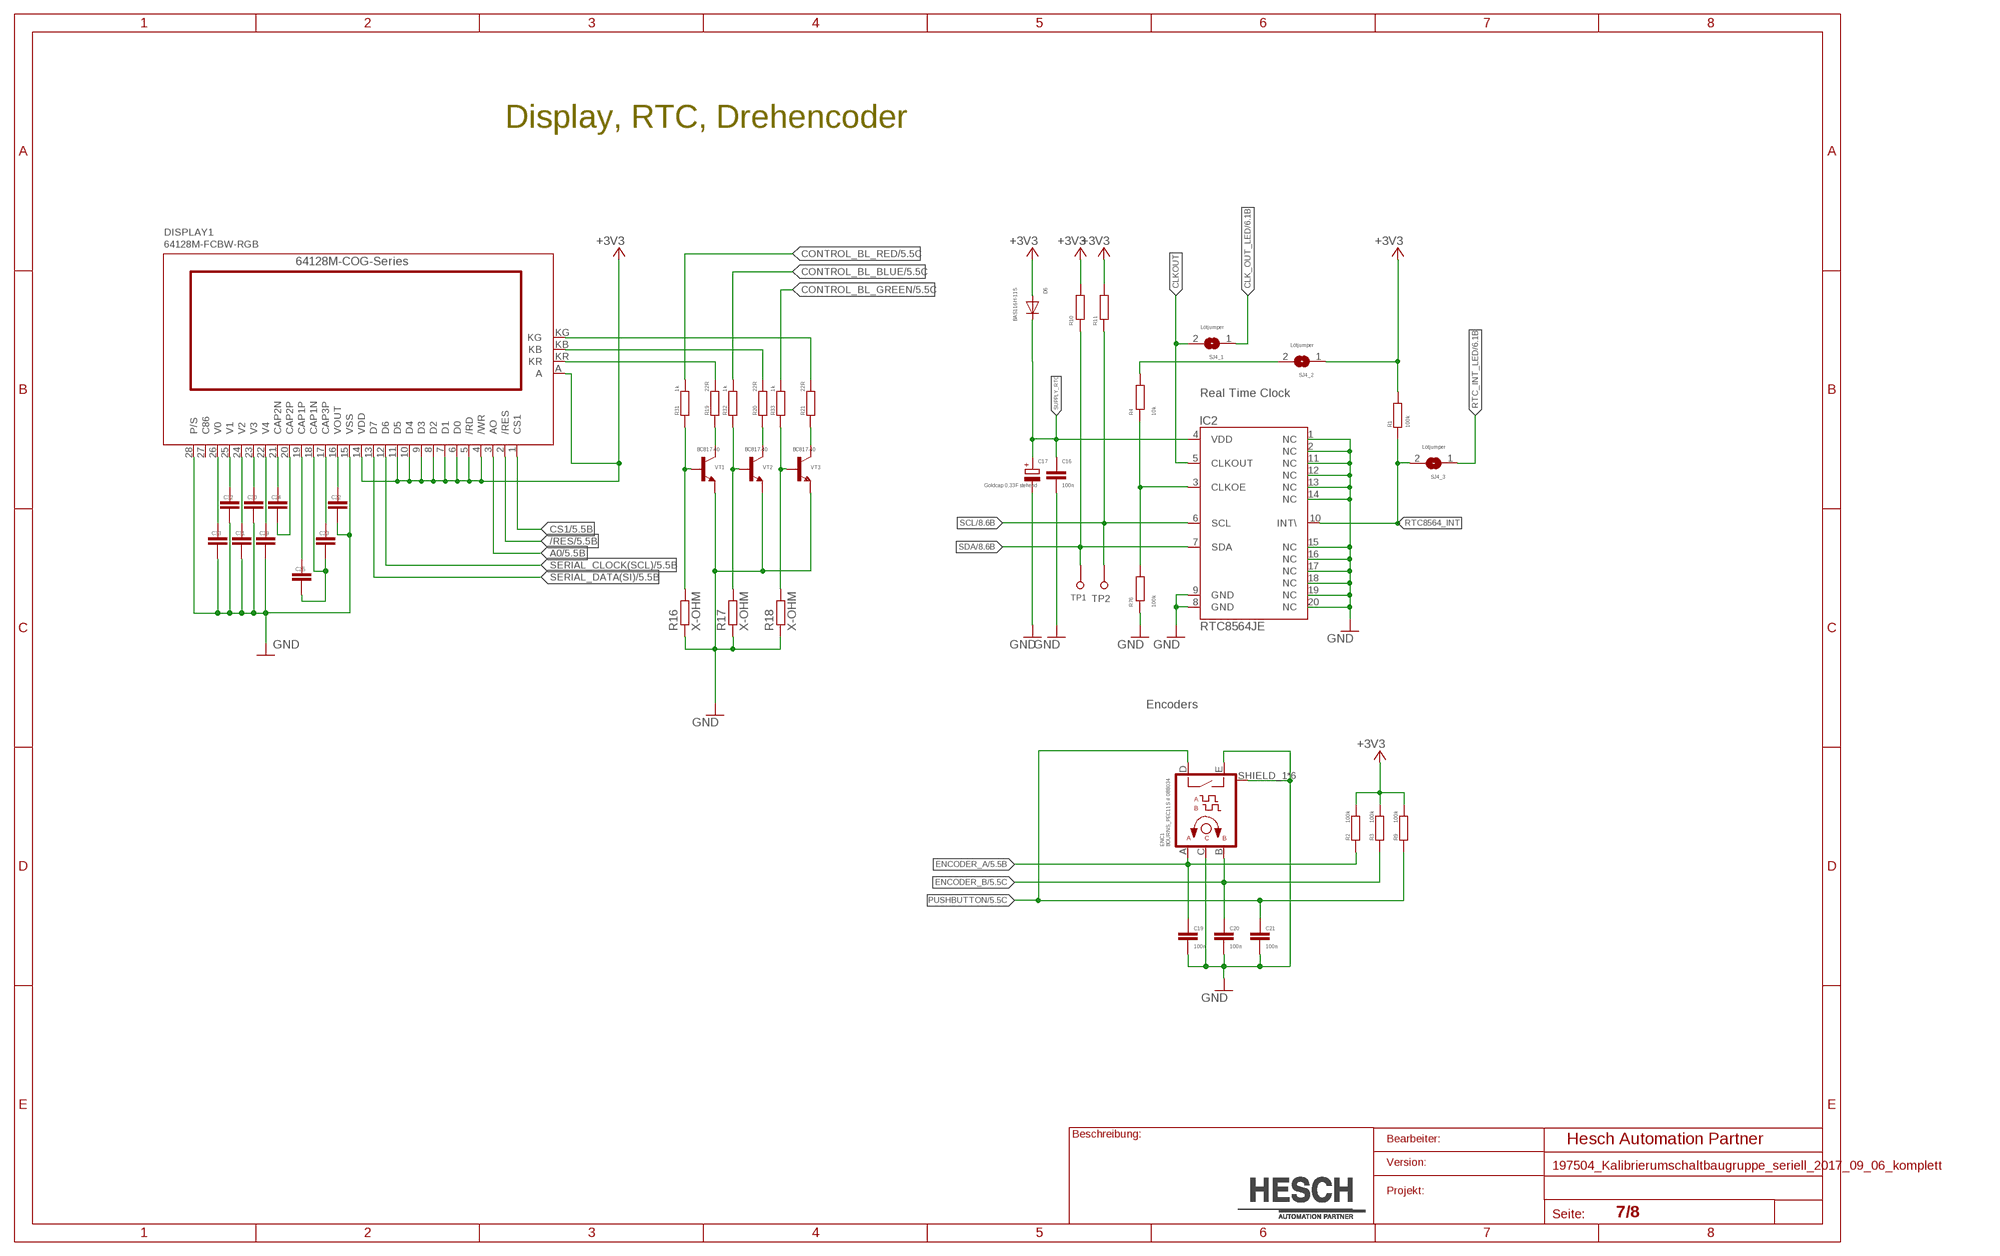
[diagram p6: schematic, sheet 7]

### Parts
C16  100n  C-EUC0603  [C0603]
C17  Goldcap 0,33F stehend  PANASONIC-EN&SD-SERIESTHT_1  [PANASONIC_SD_SERIES_STEHEND]  (not fitted in variant Relais_Switchbox_USB)
C19  100n  C-EUC0603  [C0603]
C20  100n  C-EUC0603  [C0603]
C21  100n  C-EUC0603  [C0603]
C22  1µ / X7R / 25V mind.  C-EUC0603  [C0603]  (not fitted in variant Relais_Switchbox_USB)  (not fitted in variant Development_Board_7_Segment_2017)
C23  1µ / X7R / 25V mind.  C-EUC0603  [C0603]  (not fitted in variant Relais_Switchbox_USB)  (not fitted in variant Development_Board_7_Segment_2017)
C24  1µ / X7R / 25V mind.  C-EUC0603  [C0603]  (not fitted in variant Relais_Switchbox_USB)  (not fitted in variant Development_Board_7_Segment_2017)
C25  1µ / X7R / 25V mind.  C-EUC0603  [C0603]  (not fitted in variant Relais_Switchbox_USB)  (not fitted in variant Development_Board_7_Segment_2017)
C29  1µ / X7R / 25V mind.  C-EUC0603  [C0603]  (not fitted in variant Relais_Switchbox_USB)  (not fitted in variant Development_Board_7_Segment_2017)
C30  1µ / X7R / 25V mind.  C-EUC0603  [C0603]  (not fitted in variant Relais_Switchbox_USB)  (not fitted in variant Development_Board_7_Segment_2017)
C31  1µ / X7R / 25V mind.  C-EUC0603  [C0603]  (not fitted in variant Relais_Switchbox_USB)  (not fitted in variant Development_Board_7_Segment_2017)
C32  1µ / X7R / 25V mind.  C-EUC0603  [C0603]  (not fitted in variant Relais_Switchbox_USB)  (not fitted in variant Development_Board_7_Segment_2017)
C33  1µ / X7R / 25V mind.  C-EUC0603  [C0603]  (not fitted in variant Relais_Switchbox_USB)  (not fitted in variant Development_Board_7_Segment_2017)
D6  BAS116H-115  [SOD123]  (not fitted in variant Relais_Switchbox_USB)
DISPLAY1  64128M-FCBW-RGB  DISPLAYTECH_64128M-FCBW-RGB_COG_SERIES_GLCD-128X68COG  [DISPLAYTECH_64128M-FCBW-RGB_COG_SERIES_GLCD-128X68COG]  (not fitted in variant Relais_Switchbox_USB)  (not fitted in variant Development_Board_7_Segment_2017)
ENC1  BOURNS_PEC11S # 088034  BOURNS_PEC11S  [BOURNS_PEC11S]  (not fitted in variant Relais_Switchbox_USB)
IC2  EPSON RTC8564JE  RTC8564JESMD  [VSOJ20]  (not fitted in variant Relais_Switchbox_USB)
R1  100k  R-EU_R0603  [R0603]
R2  100k  R-EU_R0603  [R0603]
R3  100k  R-EU_R0603  [R0603]
R4  10k  R-EU_R0603  [R0603]
R9  100k  R-EU_R0603  [R0603]
R10  4,7k  R-EU_R0603  [R0603]
R11  4,7k  R-EU_R0603  [R0603]
R16  X-OHM  R-EU_R0603  [R0603]
R17  X-OHM  R-EU_R0603  [R0603]
R18  X-OHM  R-EU_R0603  [R0603]
R19  22R  R-EU_R1206  [R1206]
R20  22R  R-EU_R1206  [R1206]
R21  22R  R-EU_R1206  [R1206]
R31  1k  R-EU_R0603  [R0603]
R32  1k  R-EU_R0603  [R0603]
R33  1k  R-EU_R0603  [R0603]
R76  100k  R-EU_R0603  [R0603]
SJ4_1  Lötjumper  SJ  [SJ]
SJ4_2  Lötjumper  SJ  [SJ]
SJ4_3  Lötjumper  SJ  [SJ]  (not fitted in variant Development_Board_Graphic_LCD)
TP1  Testpad_mit_Bohrung  PAD´S8  [THT-1X2,54]
TP2  Testpad_mit_Bohrung  PAD´S8  [THT-1X2,54]
VT1  BC817-40  BC847-NPN-SOT23-BEC  [SOT23-BEC]  (not fitted in variant Relais_Switchbox_USB)
VT2  BC817-40  BC847-NPN-SOT23-BEC  [SOT23-BEC]  (not fitted in variant Relais_Switchbox_USB)
VT3  BC817-40  BC847-NPN-SOT23-BEC  [SOT23-BEC]  (not fitted in variant Relais_Switchbox_USB)

### Nets
+3V3: D6.A DISPLAY1.4(/WR) DISPLAY1.5(/RD) DISPLAY1.6(D0) DISPLAY1.7(D1) DISPLAY1.8(D2) DISPLAY1.9(D3) DISPLAY1.10(D4) DISPLAY1.11(D5) DISPLAY1.14(VDD) DISPLAY1.A R1.2 R2.2 R3.2 R9.2 R10.2 R11.2 SJ4_2.1 ; also sheet 3,5,6,8
/RES: DISPLAY1.2(/RES) ; also sheet 5
A0: DISPLAY1.3(AO) ; also sheet 5
CLK_OUT_LED: SJ4_1.1 ; also sheet 6
CLKOUT: IC2.5(CLKOUT) SJ4_1.2
CONTROL_BL_BLUE: R32.2 ; also sheet 5
CONTROL_BL_GREEN: R33.2 ; also sheet 5
CONTROL_BL_RED: R31.2 ; also sheet 5
CS1: DISPLAY1.1(CS1) ; also sheet 5
ENCODER_A: C19.1 ENC1.A R2.1 ; also sheet 5
ENCODER_B: C20.1 ENC1.B R3.1 ; also sheet 5
GND: C16.2 C17.- C19.2 C20.2 C21.2 C22.1 C29.1 C30.1 C31.1 C32.1 C33.1 DISPLAY1.15(VSS) DISPLAY1.28(P/S) ENC1.C ENC1.E ENC1.SHIELD_1 ENC1.SHIELD_2(SHIELD_1) ENC1.SHIELD_3(SHIELD_1) ENC1.SHIELD_4(SHIELD_1) ENC1.SHIELD_5(SHIELD_1) ENC1.SHIELD_6(SHIELD_1) IC2.1(NC) IC2.2(NC) IC2.8(GND) IC2.9(GND) IC2.11(NC) IC2.12(NC) IC2.13(NC) IC2.14(NC) IC2.15(NC) IC2.16(NC) IC2.17(NC) IC2.18(NC) IC2.19(NC) IC2.20(NC) R16.1 R17.1 R18.1 R76.1 VT1.E VT2.E VT3.E ; also sheet 3,4,5,6,8
N$12: IC2.3(CLKOE) R4.1 R76.2
N$13: C22.2 DISPLAY1.16(VOUT)
N$19: R16.2 R31.1 VT1.B
N$20: R17.2 R32.1 VT2.B
N$23: R4.2 SJ4_2.2
N$24: R18.2 R33.1 VT3.B
N$37: DISPLAY1.KG R21.2
N$41: C23.2 DISPLAY1.17(CAP3P)
N$50: C23.1 C25.1 DISPLAY1.18(CAP1N)
N$51: C25.2 DISPLAY1.19(CAP1P)
N$52: DISPLAY1.KB R20.2
N$53: C24.2 DISPLAY1.21(CAP2N)
N$54: C24.1 DISPLAY1.20(CAP2P)
N$55: C29.2 DISPLAY1.22(V4)
N$56: C30.2 DISPLAY1.23(V3)
N$57: C31.2 DISPLAY1.24(V2)
N$58: C32.2 DISPLAY1.25(V1)
N$59: C33.2 DISPLAY1.26(V0)
N$60: DISPLAY1.KR R19.2
N$61: R20.1 VT2.C
N$62: R21.1 VT3.C
N$66: R19.1 VT1.C
PUSHBUTTON: C21.1 ENC1.D R9.1 ; also sheet 5
RTC8564_INT: IC2.10(INT\) R1.1 SJ4_3.2
RTC_INT_LED: SJ4_3.1 ; also sheet 6
SCL: IC2.6(SCL) R11.1 TP2.TP ; also sheet 5,8
SDA: IC2.7(SDA) R10.1 TP1.TP ; also sheet 5,8
SERIAL_CLOCK(SCL): DISPLAY1.12(D6) ; also sheet 5
SERIAL_DATA(SI): DISPLAY1.13(D7) ; also sheet 5
SUPPLY_RTC: C16.1 C17.+ D6.C IC2.4(VDD)
Unconnected: DISPLAY1.27(C86)

### Notes on the sheet
- Display, RTC, Drehencoder
- Real Time Clock
- Encoders

## Sheet 8 of 8
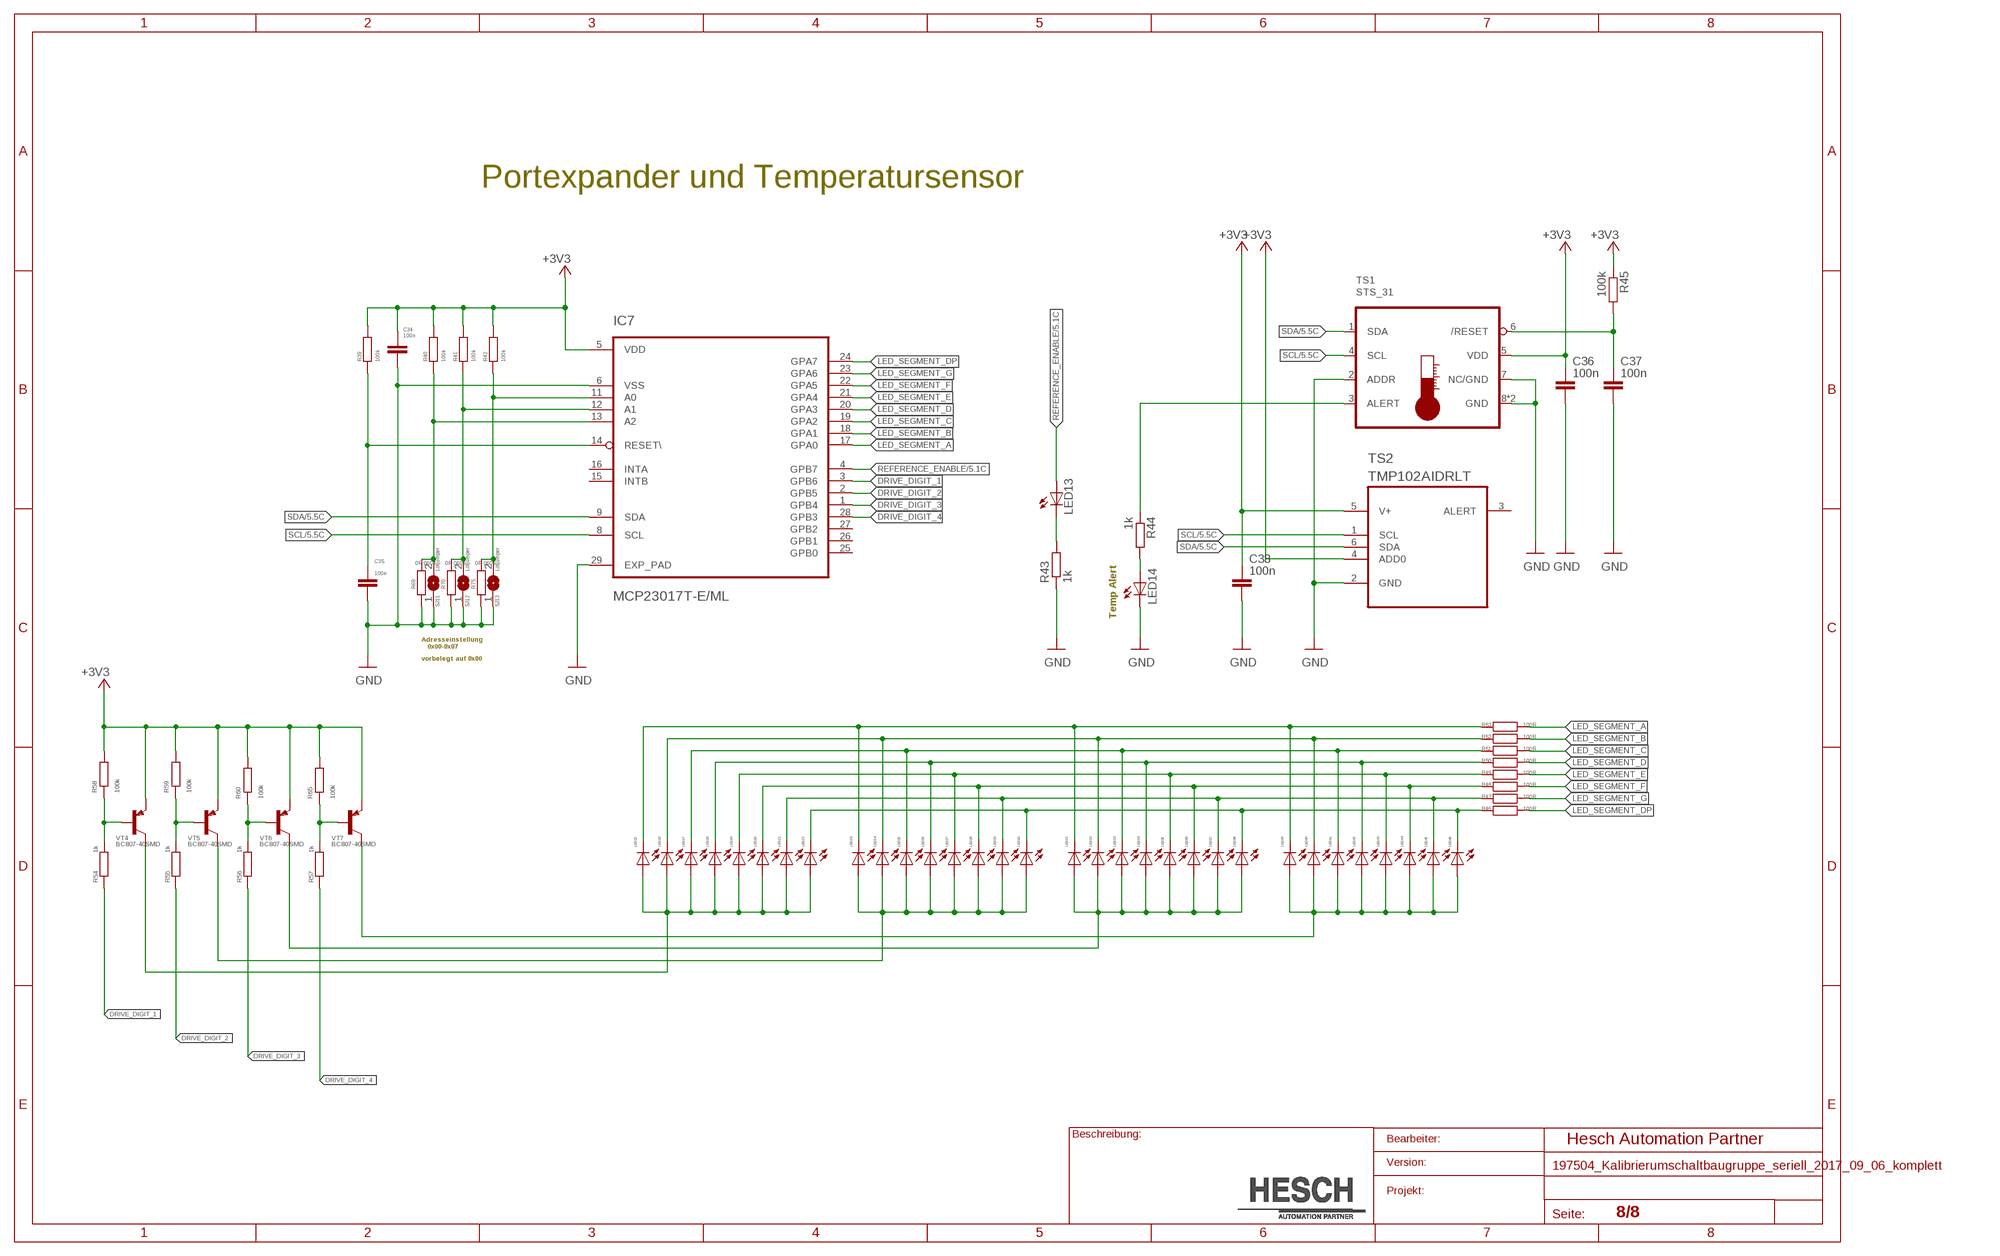
[diagram p7: schematic, sheet 8]

### Parts
C34  100n  C-EUC0603  [C0603]  (not fitted in variant Development_Board_Graphic_LCD)
C35  100n  C-EUC0603  [C0603]  (not fitted in variant Relais_Switchbox_USB)  (not fitted in variant Development_Board_Graphic_LCD)
C36  100n  C-EUC0603  [C0603]
C37  100n  C-EUC0603  [C0603]
C38  100n  C-EUC0603  [C0603]  (not fitted in variant Relais_Switchbox_USB)  (not fitted in variant Development_Board_Graphic_LCD)
IC7  MCP23017T-E/ML  [QFN28_RM_0,65]  (not fitted in variant Relais_Switchbox_USB)  (not fitted in variant Development_Board_Graphic_LCD)
LED13  0805_blue  LEDCHIPLED_0805  [CHIPLED_0805]  (not fitted in variant Relais_Switchbox_USB)  (not fitted in variant Development_Board_Graphic_LCD)
LED14  0805_blue  LEDCHIPLED_0805  [CHIPLED_0805]
LED15  LED_0603  LEDCHIPLED_0603  [CHIPLED_0603]  (not fitted in variant Relais_Switchbox_USB)  (not fitted in variant Development_Board_Graphic_LCD)
LED16  LED_0603  LEDCHIPLED_0603  [CHIPLED_0603]  (not fitted in variant Relais_Switchbox_USB)  (not fitted in variant Development_Board_Graphic_LCD)
LED17  LED_0603  LEDCHIPLED_0603  [CHIPLED_0603]  (not fitted in variant Relais_Switchbox_USB)  (not fitted in variant Development_Board_Graphic_LCD)
LED18  LED_0603  LEDCHIPLED_0603  [CHIPLED_0603]  (not fitted in variant Relais_Switchbox_USB)  (not fitted in variant Development_Board_Graphic_LCD)
LED19  LED_0603  LEDCHIPLED_0603  [CHIPLED_0603]  (not fitted in variant Relais_Switchbox_USB)  (not fitted in variant Development_Board_Graphic_LCD)
LED20  LED_0603  LEDCHIPLED_0603  [CHIPLED_0603]  (not fitted in variant Relais_Switchbox_USB)  (not fitted in variant Development_Board_Graphic_LCD)
LED21  LED_0603  LEDCHIPLED_0603  [CHIPLED_0603]  (not fitted in variant Relais_Switchbox_USB)  (not fitted in variant Development_Board_Graphic_LCD)
LED22  LED_0603  LEDCHIPLED_0603  [CHIPLED_0603]  (not fitted in variant Relais_Switchbox_USB)  (not fitted in variant Development_Board_Graphic_LCD)
LED23  LED_0603  LEDCHIPLED_0603  [CHIPLED_0603]  (not fitted in variant Relais_Switchbox_USB)  (not fitted in variant Development_Board_Graphic_LCD)
LED24  LED_0603  LEDCHIPLED_0603  [CHIPLED_0603]  (not fitted in variant Relais_Switchbox_USB)  (not fitted in variant Development_Board_Graphic_LCD)
LED25  LED_0603  LEDCHIPLED_0603  [CHIPLED_0603]  (not fitted in variant Relais_Switchbox_USB)  (not fitted in variant Development_Board_Graphic_LCD)
LED26  LED_0603  LEDCHIPLED_0603  [CHIPLED_0603]  (not fitted in variant Relais_Switchbox_USB)  (not fitted in variant Development_Board_Graphic_LCD)
LED27  LED_0603  LEDCHIPLED_0603  [CHIPLED_0603]  (not fitted in variant Relais_Switchbox_USB)  (not fitted in variant Development_Board_Graphic_LCD)
LED28  LED_0603  LEDCHIPLED_0603  [CHIPLED_0603]  (not fitted in variant Relais_Switchbox_USB)  (not fitted in variant Development_Board_Graphic_LCD)
LED29  LED_0603  LEDCHIPLED_0603  [CHIPLED_0603]  (not fitted in variant Relais_Switchbox_USB)  (not fitted in variant Development_Board_Graphic_LCD)
LED30  LED_0603  LEDCHIPLED_0603  [CHIPLED_0603]  (not fitted in variant Relais_Switchbox_USB)  (not fitted in variant Development_Board_Graphic_LCD)
LED31  LED_0603  LEDCHIPLED_0603  [CHIPLED_0603]  (not fitted in variant Relais_Switchbox_USB)  (not fitted in variant Development_Board_Graphic_LCD)
LED32  LED_0603  LEDCHIPLED_0603  [CHIPLED_0603]  (not fitted in variant Relais_Switchbox_USB)  (not fitted in variant Development_Board_Graphic_LCD)
LED33  LED_0603  LEDCHIPLED_0603  [CHIPLED_0603]  (not fitted in variant Relais_Switchbox_USB)  (not fitted in variant Development_Board_Graphic_LCD)
LED34  LED_0603  LEDCHIPLED_0603  [CHIPLED_0603]  (not fitted in variant Relais_Switchbox_USB)  (not fitted in variant Development_Board_Graphic_LCD)
LED35  LED_0603  LEDCHIPLED_0603  [CHIPLED_0603]  (not fitted in variant Relais_Switchbox_USB)  (not fitted in variant Development_Board_Graphic_LCD)
LED36  LED_0603  LEDCHIPLED_0603  [CHIPLED_0603]  (not fitted in variant Relais_Switchbox_USB)  (not fitted in variant Development_Board_Graphic_LCD)
LED37  LED_0603  LEDCHIPLED_0603  [CHIPLED_0603]  (not fitted in variant Relais_Switchbox_USB)  (not fitted in variant Development_Board_Graphic_LCD)
LED38  LED_0603  LEDCHIPLED_0603  [CHIPLED_0603]  (not fitted in variant Relais_Switchbox_USB)  (not fitted in variant Development_Board_Graphic_LCD)
LED39  LED_0603  LEDCHIPLED_0603  [CHIPLED_0603]  (not fitted in variant Relais_Switchbox_USB)  (not fitted in variant Development_Board_Graphic_LCD)
LED40  LED_0603  LEDCHIPLED_0603  [CHIPLED_0603]  (not fitted in variant Relais_Switchbox_USB)  (not fitted in variant Development_Board_Graphic_LCD)
LED41  LED_0603  LEDCHIPLED_0603  [CHIPLED_0603]  (not fitted in variant Relais_Switchbox_USB)  (not fitted in variant Development_Board_Graphic_LCD)
LED42  LED_0603  LEDCHIPLED_0603  [CHIPLED_0603]  (not fitted in variant Relais_Switchbox_USB)  (not fitted in variant Development_Board_Graphic_LCD)
LED43  LED_0603  LEDCHIPLED_0603  [CHIPLED_0603]  (not fitted in variant Relais_Switchbox_USB)  (not fitted in variant Development_Board_Graphic_LCD)
LED44  LED_0603  LEDCHIPLED_0603  [CHIPLED_0603]  (not fitted in variant Relais_Switchbox_USB)  (not fitted in variant Development_Board_Graphic_LCD)
LED45  LED_0603  LEDCHIPLED_0603  [CHIPLED_0603]  (not fitted in variant Relais_Switchbox_USB)  (not fitted in variant Development_Board_Graphic_LCD)
LED46  LED_0603  LEDCHIPLED_0603  [CHIPLED_0603]  (not fitted in variant Relais_Switchbox_USB)  (not fitted in variant Development_Board_Graphic_LCD)
R39  100k  R-EU_R0603  [R0603]  (not fitted in variant Relais_Switchbox_USB)  (not fitted in variant Development_Board_Graphic_LCD)
R40  100k  R-EU_R0603  [R0603]  (not fitted in variant Relais_Switchbox_USB)  (not fitted in variant Development_Board_Graphic_LCD)
R41  100k  R-EU_R0603  [R0603]  (not fitted in variant Relais_Switchbox_USB)  (not fitted in variant Development_Board_Graphic_LCD)
R42  100k  R-EU_R0603  [R0603]  (not fitted in variant Relais_Switchbox_USB)  (not fitted in variant Development_Board_Graphic_LCD)
R43  1k  R-EU_R0603  [R0603]  (not fitted in variant Relais_Switchbox_USB)  (not fitted in variant Development_Board_Graphic_LCD)
R44  1k  R-EU_R0603  [R0603]
R45  100k  R-EU_R0603  [R0603]
R46  100R  R-EU_R0805  [R0805]  (not fitted in variant Relais_Switchbox_USB)  (not fitted in variant Development_Board_Graphic_LCD)
R47  100R  R-EU_R0805  [R0805]  (not fitted in variant Relais_Switchbox_USB)  (not fitted in variant Development_Board_Graphic_LCD)
R48  100R  R-EU_R0805  [R0805]  (not fitted in variant Relais_Switchbox_USB)  (not fitted in variant Development_Board_Graphic_LCD)
R49  100R  R-EU_R0805  [R0805]  (not fitted in variant Relais_Switchbox_USB)  (not fitted in variant Development_Board_Graphic_LCD)
R50  100R  R-EU_R0805  [R0805]  (not fitted in variant Relais_Switchbox_USB)  (not fitted in variant Development_Board_Graphic_LCD)
R51  100R  R-EU_R0805  [R0805]  (not fitted in variant Relais_Switchbox_USB)  (not fitted in variant Development_Board_Graphic_LCD)
R52  100R  R-EU_R0805  [R0805]  (not fitted in variant Relais_Switchbox_USB)  (not fitted in variant Development_Board_Graphic_LCD)
R53  100R  R-EU_R0805  [R0805]  (not fitted in variant Relais_Switchbox_USB)  (not fitted in variant Development_Board_Graphic_LCD)
R54  1k  R-EU_R0603  [R0603]  (not fitted in variant Relais_Switchbox_USB)  (not fitted in variant Development_Board_Graphic_LCD)
R55  1k  R-EU_R0603  [R0603]  (not fitted in variant Relais_Switchbox_USB)  (not fitted in variant Development_Board_Graphic_LCD)
R56  1k  R-EU_R0603  [R0603]  (not fitted in variant Relais_Switchbox_USB)  (not fitted in variant Development_Board_Graphic_LCD)
R57  1k  R-EU_R0603  [R0603]  (not fitted in variant Relais_Switchbox_USB)  (not fitted in variant Development_Board_Graphic_LCD)
R58  100k  R-EU_R0603  [R0603]  (not fitted in variant Relais_Switchbox_USB)  (not fitted in variant Development_Board_Graphic_LCD)
R59  100k  R-EU_R0603  [R0603]  (not fitted in variant Relais_Switchbox_USB)  (not fitted in variant Development_Board_Graphic_LCD)
R60  100k  R-EU_R0603  [R0603]  (not fitted in variant Relais_Switchbox_USB)  (not fitted in variant Development_Board_Graphic_LCD)
R65  100k  R-EU_R0603  [R0603]  (not fitted in variant Relais_Switchbox_USB)  (not fitted in variant Development_Board_Graphic_LCD)
R69  0R 0603  R-EU_R0603  [R0603]  (not fitted in variant Development_Board_Graphic_LCD)  (not fitted in variant Relais_Switchbox_USB)
R70  0R 0603  R-EU_R0603  [R0603]  (not fitted in variant Development_Board_Graphic_LCD)  (not fitted in variant Relais_Switchbox_USB)
R75  0R 0603  R-EU_R0603  [R0603]  (not fitted in variant Development_Board_Graphic_LCD)  (not fitted in variant Relais_Switchbox_USB)
SJ11  Lötjumper  SJ  [SJ]  (not fitted in variant Development_Board_Graphic_LCD)  (not fitted in variant Development_Board_7_Segment_2017)  (not fitted in variant Relais_Switchbox_USB)
SJ12  Lötjumper  SJ  [SJ]  (not fitted in variant Development_Board_Graphic_LCD)  (not fitted in variant Development_Board_7_Segment_2017)  (not fitted in variant Relais_Switchbox_USB)
SJ13  Lötjumper  SJ  [SJ]  (not fitted in variant Development_Board_Graphic_LCD)  (not fitted in variant Development_Board_7_Segment_2017)  (not fitted in variant Relais_Switchbox_USB)
TS1  STS_31  SENSIRION_STS_31  [DFN8]  (not fitted in variant Relais_Switchbox_USB)
TS2  TMP102AIDRLT  [SOT50P160X60-6N]  (not fitted in variant Relais_Switchbox_USB)  (not fitted in variant Development_Board_Graphic_LCD)
VT4  BC807-40SMD  [SOT23-BEC]  (not fitted in variant Relais_Switchbox_USB)  (not fitted in variant Development_Board_Graphic_LCD)
VT5  BC807-40SMD  [SOT23-BEC]  (not fitted in variant Relais_Switchbox_USB)  (not fitted in variant Development_Board_Graphic_LCD)
VT6  BC807-40SMD  [SOT23-BEC]  (not fitted in variant Relais_Switchbox_USB)  (not fitted in variant Development_Board_Graphic_LCD)
VT7  BC807-40SMD  [SOT23-BEC]  (not fitted in variant Relais_Switchbox_USB)  (not fitted in variant Development_Board_Graphic_LCD)

### Nets
+3V3: C34.1 C36.1 C38.1 IC7.5(VDD) R39.2 R40.2 R41.2 R42.2 R45.1 R58.2 R59.2 R60.2 R65.2 TS1.5(VDD) TS2.4(ADD0) TS2.5(V+) VT4.E VT5.E VT6.E VT7.E ; also sheet 3,5,6,7
ANODES_SEGMENT_1: LED15.A LED16.A LED17.A LED18.A LED19.A LED20.A LED21.A LED22.A VT4.C
ANODES_SEGMENT_2: LED23.A LED24.A LED25.A LED26.A LED27.A LED28.A LED29.A LED30.A VT5.C
ANODES_SEGMENT_3: LED31.A LED32.A LED33.A LED34.A LED35.A LED36.A LED37.A LED38.A VT6.C
ANODES_SEGMENT_4: LED39.A LED40.A LED41.A LED42.A LED43.A LED44.A LED45.A LED46.A VT7.C
DRIVE_DIGIT_1: IC7.3(GPB6) R54.1
DRIVE_DIGIT_2: IC7.2(GPB5) R55.1
DRIVE_DIGIT_3: IC7.1(GPB4) R56.1
DRIVE_DIGIT_4: IC7.28(GPB3) R57.1
GND: C34.2 C35.2 C36.2 C37.2 C38.2 IC7.6(VSS) IC7.29(EXP_PAD) LED14.C R43.1 R69.1 R70.1 R75.1 SJ11.1 SJ12.1 SJ13.1 TS1.2(ADDR) TS1.7(NC/GND) TS1.8(GND) TS1.TH(GND) TS2.2(GND) ; also sheet 3,4,5,6,7
LED_SEGMENT_A: IC7.17(GPA0) R53.2
LED_SEGMENT_A_: LED15.C LED23.C LED31.C LED39.C R53.1
LED_SEGMENT_B: IC7.18(GPA1) R52.2
LED_SEGMENT_B_: LED16.C LED24.C LED32.C LED40.C R52.1
LED_SEGMENT_C: IC7.19(GPA2) R51.2
LED_SEGMENT_C_: LED17.C LED25.C LED33.C LED41.C R51.1
LED_SEGMENT_D: IC7.20(GPA3) R50.2
LED_SEGMENT_D_: LED18.C LED26.C LED34.C LED42.C R50.1
LED_SEGMENT_DP: IC7.24(GPA7) R46.2
LED_SEGMENT_DP_: LED22.C LED30.C LED38.C LED46.C R46.1
LED_SEGMENT_E: IC7.21(GPA4) R49.2
LED_SEGMENT_E_: LED19.C LED27.C LED35.C LED43.C R49.1
LED_SEGMENT_F: IC7.22(GPA5) R48.2
LED_SEGMENT_F_: LED20.C LED28.C LED36.C LED44.C R48.1
LED_SEGMENT_G: IC7.23(GPA6) R47.2
LED_SEGMENT_G_: LED21.C LED29.C LED37.C LED45.C R47.1
N$2: LED13.C R43.2
N$34: C35.1 IC7.14(RESET\) R39.1
N$38: IC7.11(A0) R42.1 R75.2 SJ13.2
N$63: IC7.13(A2) R40.1 R69.2 SJ11.2
N$64: IC7.12(A1) R41.1 R70.2 SJ12.2
N$69: R57.2 R65.1 VT7.B
N$70: LED14.A R44.2
N$71: C37.1 R45.2 TS1.6(/RESET)
N$72: R56.2 R60.1 VT6.B
N$74: R44.1 TS1.3(ALERT)
N$83: R55.2 R59.1 VT5.B
N$84: R54.2 R58.1 VT4.B
REFERENCE_ENABLE: IC7.4(GPB7) LED13.A ; also sheet 5
SCL: IC7.8(SCL) TS1.4(SCL) TS2.1(SCL) ; also sheet 5,7
SDA: IC7.9(SDA) TS1.1(SDA) TS2.6(SDA) ; also sheet 5,7
Unconnected: IC7.15(INTB) IC7.16(INTA) IC7.25(GPB0) IC7.26(GPB1) IC7.27(GPB2) TS2.3(ALERT)

### Notes on the sheet
- Portexpander und Temperatursensor
- Temp Alert
- Adresseinstellung
     0x00-0x07
- vorbelegt auf 0x00

## Library data of the parts
BUZ1 = buzzer:CA-M: Artikelnummer:< -->#Beschreibung !: 205036 __________________________________________ ***UPDATE*** Datum : 07.04.2016 11:26:15 -->Bauteil neu angelegt __________________________________________ generated by Eagle Description Tool erstellt von: Wl
C1 C5-C7 C9 C11 C13 C15 C16 C18-C40 = rcl:C-EU: CAPACITOR, European symbol
C2-C4 C8 C14 = resistor:C-EU: CAPACITOR, European symbol
C10 C12 = rcl:CPOL-EU: POLARIZED CAPACITOR, European symbol
C17 = Kondensator - GoldCaps:PANASONIC-EN&SD-SERIES: Name des Bauteiles: -->Doppelschicht Kondensator Daten:radial (stehend), 70°C, 5,5V Artikelnummer:#014000 Datenblatt:www.alldatasheet.com __________________________________________ generated by Eagle Description Tool am : 23.01.2014 13:04:36 erstellt von: Hm
D1 D3 D5 D7-D9 = diode:SUPPRESSOR-: Suppressor diode
D2 D4 = Dioden:SS24: Name des Bauteiles: SMD-Schottkydiode SS24 Daten: Bauform DO-214AA/SMB; 40 V / 2 A Artikelnummer:#105032 Datenblatt:
D6 = Dioden:BAS116H: Name des Bauteiles: -->BAS116H Daten:BAS116H Ultra Low Leakage Diode speziell für die energiesparende Verbindung von Goldcaps mit Echtzeituhren, extrem kleiner Leckstrom Artikelnummer:#105016 Datenblatt:www.alldatasheet.com __________________________________________ generated by Eagle Description Tool am : 29.01.2014 07:16:55 erstellt von: Hm
DISPLAY1 = Displays:DISPLAYTECH_64128M-FCBW-RGB_COG_SERIES_GLCD-128X68COG: Displaytech 128x64_COG_Series Daten:75mm x 50mm, VDD 3.0V Artikelnummer:#keine feste Artikelnummer vorhanden / Atikel nicht lagermäßig vorhanden! Datenblatt:https://www.displaytech-us.com/128x64-graphic-lcd-displays-m __________________________________________ generated by Eagle Description Tool am : 22.01.2014 14:51:03 erstellt von: Gz
ENC1 = ALPS:BOURNS_PEC11S
F1 = Sicherung - SMD PTC:1812
F2 F3 = Sicherung - SMD PTC:1206L
FIDU1-FIDU3 = Passermarken:FIDUCIALS
IC1 = v-reg:LM317?*: 500 mA Adjustable Output Positive Voltage Regulator Source: http://www.onsemi.co.jp .. LM317M-D.PDF
IC2 = Echtzeituhr - RTC8564JE:RTC8564JE: Name des Bauteiles: -->RTC8564JE Daten:Bauform : VSO120 Artikelnummer:#045172 Datenblatt:www.alldatasheet.com __________________________________________ generated by Eagle Description Tool am : 23.01.2014 10:55:17 erstellt von: Hm
IC3 IC4 = uln-udn:ULN2003A: DRIVER ARRAY
IC7 = Microchip_MCP23017:MCP23017T-E/ML: 16-bit-Portexpander I²C; PACKAGE: QFN-28; PARTNUMBER: MCP23017T-E/ML; SUPPLIER: Microchip
IC8 = atmel:MEGA32: MICROCONTROLLER 32 Kbytes FLASH 2 Kbytes SRAM 1 Kbytes EEPROM USART 8-channel 10 bit ADC Source: www.atmel.com .. doc2503.pdf; MPN: ATMEGA32-16AU; OC_FARNELL: 9171274; OC_NEWARK: 69K6677
IC9 = USB Treiber - CP2102:CP2102: Name des Bauteiles:USB/UART-Wandlerr Daten:SMD. QFN 28, Silicon LAB: CP2102-GMR Artikelnummer: #045194 Datenblatt:www.alldatascheet.com
IC10 = USB - Suppressor Dioden:TPD2E001: Name des Bauteiles: -->TPD2E001 Daten:Array / 3x3 QFN - DRS, IC USB ESD Protection Artikelnummer:#045293 Datenblatt:Siehe Hesch Suche ! __________________________________________ generated by Eagle Description Tool am : 28.11.2014 08:00:41 erstellt von: Hm
K1-K8 = Relais_Panasonic:PANASONIC_TQ_SMD
L1 = wuerth_elektronik_eisos__v6.8_20100429:WE-PD4: SMD-Power Inductors WE-PD4 - Current loading up to 35 A - Compact size - Low-loss ferrite core - High storage capacity - Industry standardized size - Application frequency range up to 10 MHz -- Is recommended for the application with switching regulators from National Semiconductor, Linear Technology, Texas Instruments and Fairchild Semiconductor -- Noise suppression -- Perfectly suitable for switching regulators with extremely high efficiency
L2 = rcl:L-EU: INDUCTOR, European symbol
LED1-LED46 = led:LED: LED OSRAM: - CHIPLED LG R971, LG N971, LY N971, LG Q971, LY Q971, LO R971, LY R971 LH N974, LH R974 LS Q976, LO Q976, LY Q976 LO Q996 - Hyper CHIPLED LW Q18S LB Q993, LB Q99A, LB R99A - SideLED LS A670, LO A670, LY A670, LG A670, LP A670 LB A673, LV A673, LT A673, LW A673 LH A674 LY A675 LS A676, LA A676, LO A676, LY A676, LW A676 LS A679, LY A679, LG A679 - Hyper Micro SIDELED® LS Y876, LA Y876, LO Y876, LY Y876 LT Y87S - SmartLED LW L88C, LW L88S LB L89C, LB L89S, LG L890 LS L89K, LO L89K, LY L89K LS L896, LA L896, LO L896, LY L896 - TOPLED LS T670, LO T670, LY T670, LG T670, LP T670 LSG T670, LSP T670, LSY T670, LOP T670, LYG T670 LG T671, LOG T671, LSG T671 LB T673, LV T673, LT T673, LW T673 LH T674 LS T676, LA T676, LO T676, LY T676, LB T676, LH T676, LSB T676, LW T676 LB T67C, LV T67C, LT T67C, LS T67K, LO T67K, LY T67K, LW E67C LS E67B, LA E67B, LO E67B, LY E67B, LB E67C, LV E67C, LT E67C LW T67C LS T679, LY T679, LG T679 LS T770, LO T770, LY T770, LG T770, LP T770 LB T773, LV T773, LT T773, LW T773 LH T774 LS E675, LA E675, LY E675, LS T675 LS T776, LA T776, LO T776, LY T776, LB T776 LHGB T686 LT T68C, LB T68C - Hyper Mini TOPLED® LB M676 - Mini TOPLED Santana® LG M470 LS M47K, LO M47K, LY M47K Source: http://www.osram.convergy.de LUXEON: - LUMILED® LXK2-PW12-R00, LXK2-PW12-S00, LXK2-PW14-U00, LXK2-PW14-V00 LXK2-PM12-R00, LXK2-PM12-S00, LXK2-PM14-U00 LXK2-PE12-Q00, LXK2-PE12-R00, LXK2-PE12-S00, LXK2-PE14-T00, LXK2-PE14-U00 LXK2-PB12-K00, LXK2-PB12-L00, LXK2-PB12-M00, LXK2-PB14-N00, LXK2-PB14-P00, LXK2-PB14-Q00 LXK2-PR12-L00, LXK2-PR12-M00, LXK2-PR14-Q00, LXK2-PR14-R00 LXK2-PD12-Q00, LXK2-PD12-R00, LXK2-PD12-S00 LXK2-PH12-R00, LXK2-PH12-S00 LXK2-PL12-P00, LXK2-PL12-Q00, LXK2-PL12-R00 Source: www.luxeon.com KINGBRIGHT: KA-3528ASYC Source: www.kingbright.com
R1-R5 R7-R12 R15-R36 R39-R76 = rcl:R-EU_: RESISTOR, European symbol
R6 R13 R14 R37 R38 = resistor:R-EU_: RESISTOR, European symbol
REF1 = LM4132AMF-2.5:LM4132AMF-2.5: Precision Low Dropout Voltage Reference; MPN: LM4132AMF-2.5; OC_FARNELL: 1312750; OC_NEWARK: 99K2466; PACKAGE: SOT23-5; SUPPLIER: NationalSemiconductor
SJ1 SJ2 SJ4_1-SJ4_3 SJ5-SJ13 = jumper:SJ: SMD solder JUMPER
SW1-SW5 = Taster - DIPTRONICS_DTSM6:DIP_DTSM6: Name des Bauteiles:SMD Taster DIPTRONICS: DTSM6 Daten: Tactile switch, 4 contacts, 6 mm x 6 mm, Height: 7mm Artikelnummer:# 088037 Datenblatt:http://www.dip.com.tw/en/en-product-information/en-switch004/item/2060-dtsm-g-6
TP1-TP7 TP11-TP14 = PAD_s:PAD´S: Name des Bauteiles: div. PAD´s Daten: Hm Artikelnummer:#k.A Datenblatt:
TP8-TP10 = testpad:TP: Test pad
TS1 = Sensirion_STS_31:SENSIRION_STS_31
TS2 = TMP102AID:TMP102AIDRLT: Temperature Sensor; MPN: TMP102AIDRLT; OC_FARNELL: 1652477; OC_NEWARK: 53M3987; PACKAGE: SOT-23-6; SUPPLIER: Texas Instruments
U2 = mc34063:MC34063
USB_BU_1 = con-berg:PN61729-S: BERG USB connector; OC_FARNELL: unknown; OC_NEWARK: unknown
VM1 = Motor - Vibrationsmotor:VIBROMOTOR: Name des Bauteiles: -->Vibrations Motor Daten:1,3 VDC - 3 VDC (Motor spez.), Imax (siehe Datenblatt) Artikelnummer:#keine feste Artikelnummer vorhanden / Atikel nicht lagermäßig vorhanden! Datenblatt:www.copal.de __________________________________________ generated by Eagle Description Tool am : 28.01.2014 11:08:41 erstellt von: Hm
VT1-VT3 = transistor-neu-to92:*-NPN-: NPN Transistror
VT4-VT7 = transistor-pnp:BC807*: PNP Transistror
X1-X3 = con-phoenix-508:MSTB6_GF
XK1 = Atmel - ISP_6   (AVR ISP MKII):WSL: Name des Bauteiles: Wannenstecker 6 pol. Daten: 6 pol. goldene Kontakte ! Artikelnummer:#131231 Datenblatt:www.datasheet.com / www.reichelt.de
XTAL1 = Quarz - HC49UP:HC49: Name des Bauteiles: -->HC49U/P Daten:16 MHz (16000000 Hz) Artikelnummer:#023006 Datenblatt:www.alldatasheet.com __________________________________________ generated by Eagle Description Tool am : 22.01.2014 13:23:52 erstellt von: Hm